# Altium project Relay Driver-10A-v1.0.PrjPcb (part 4 of 4)

## Sheet Relay_Sheet.SchDoc
size 420 x 297 mm; SheetNumber: 8; SheetTotal: 9
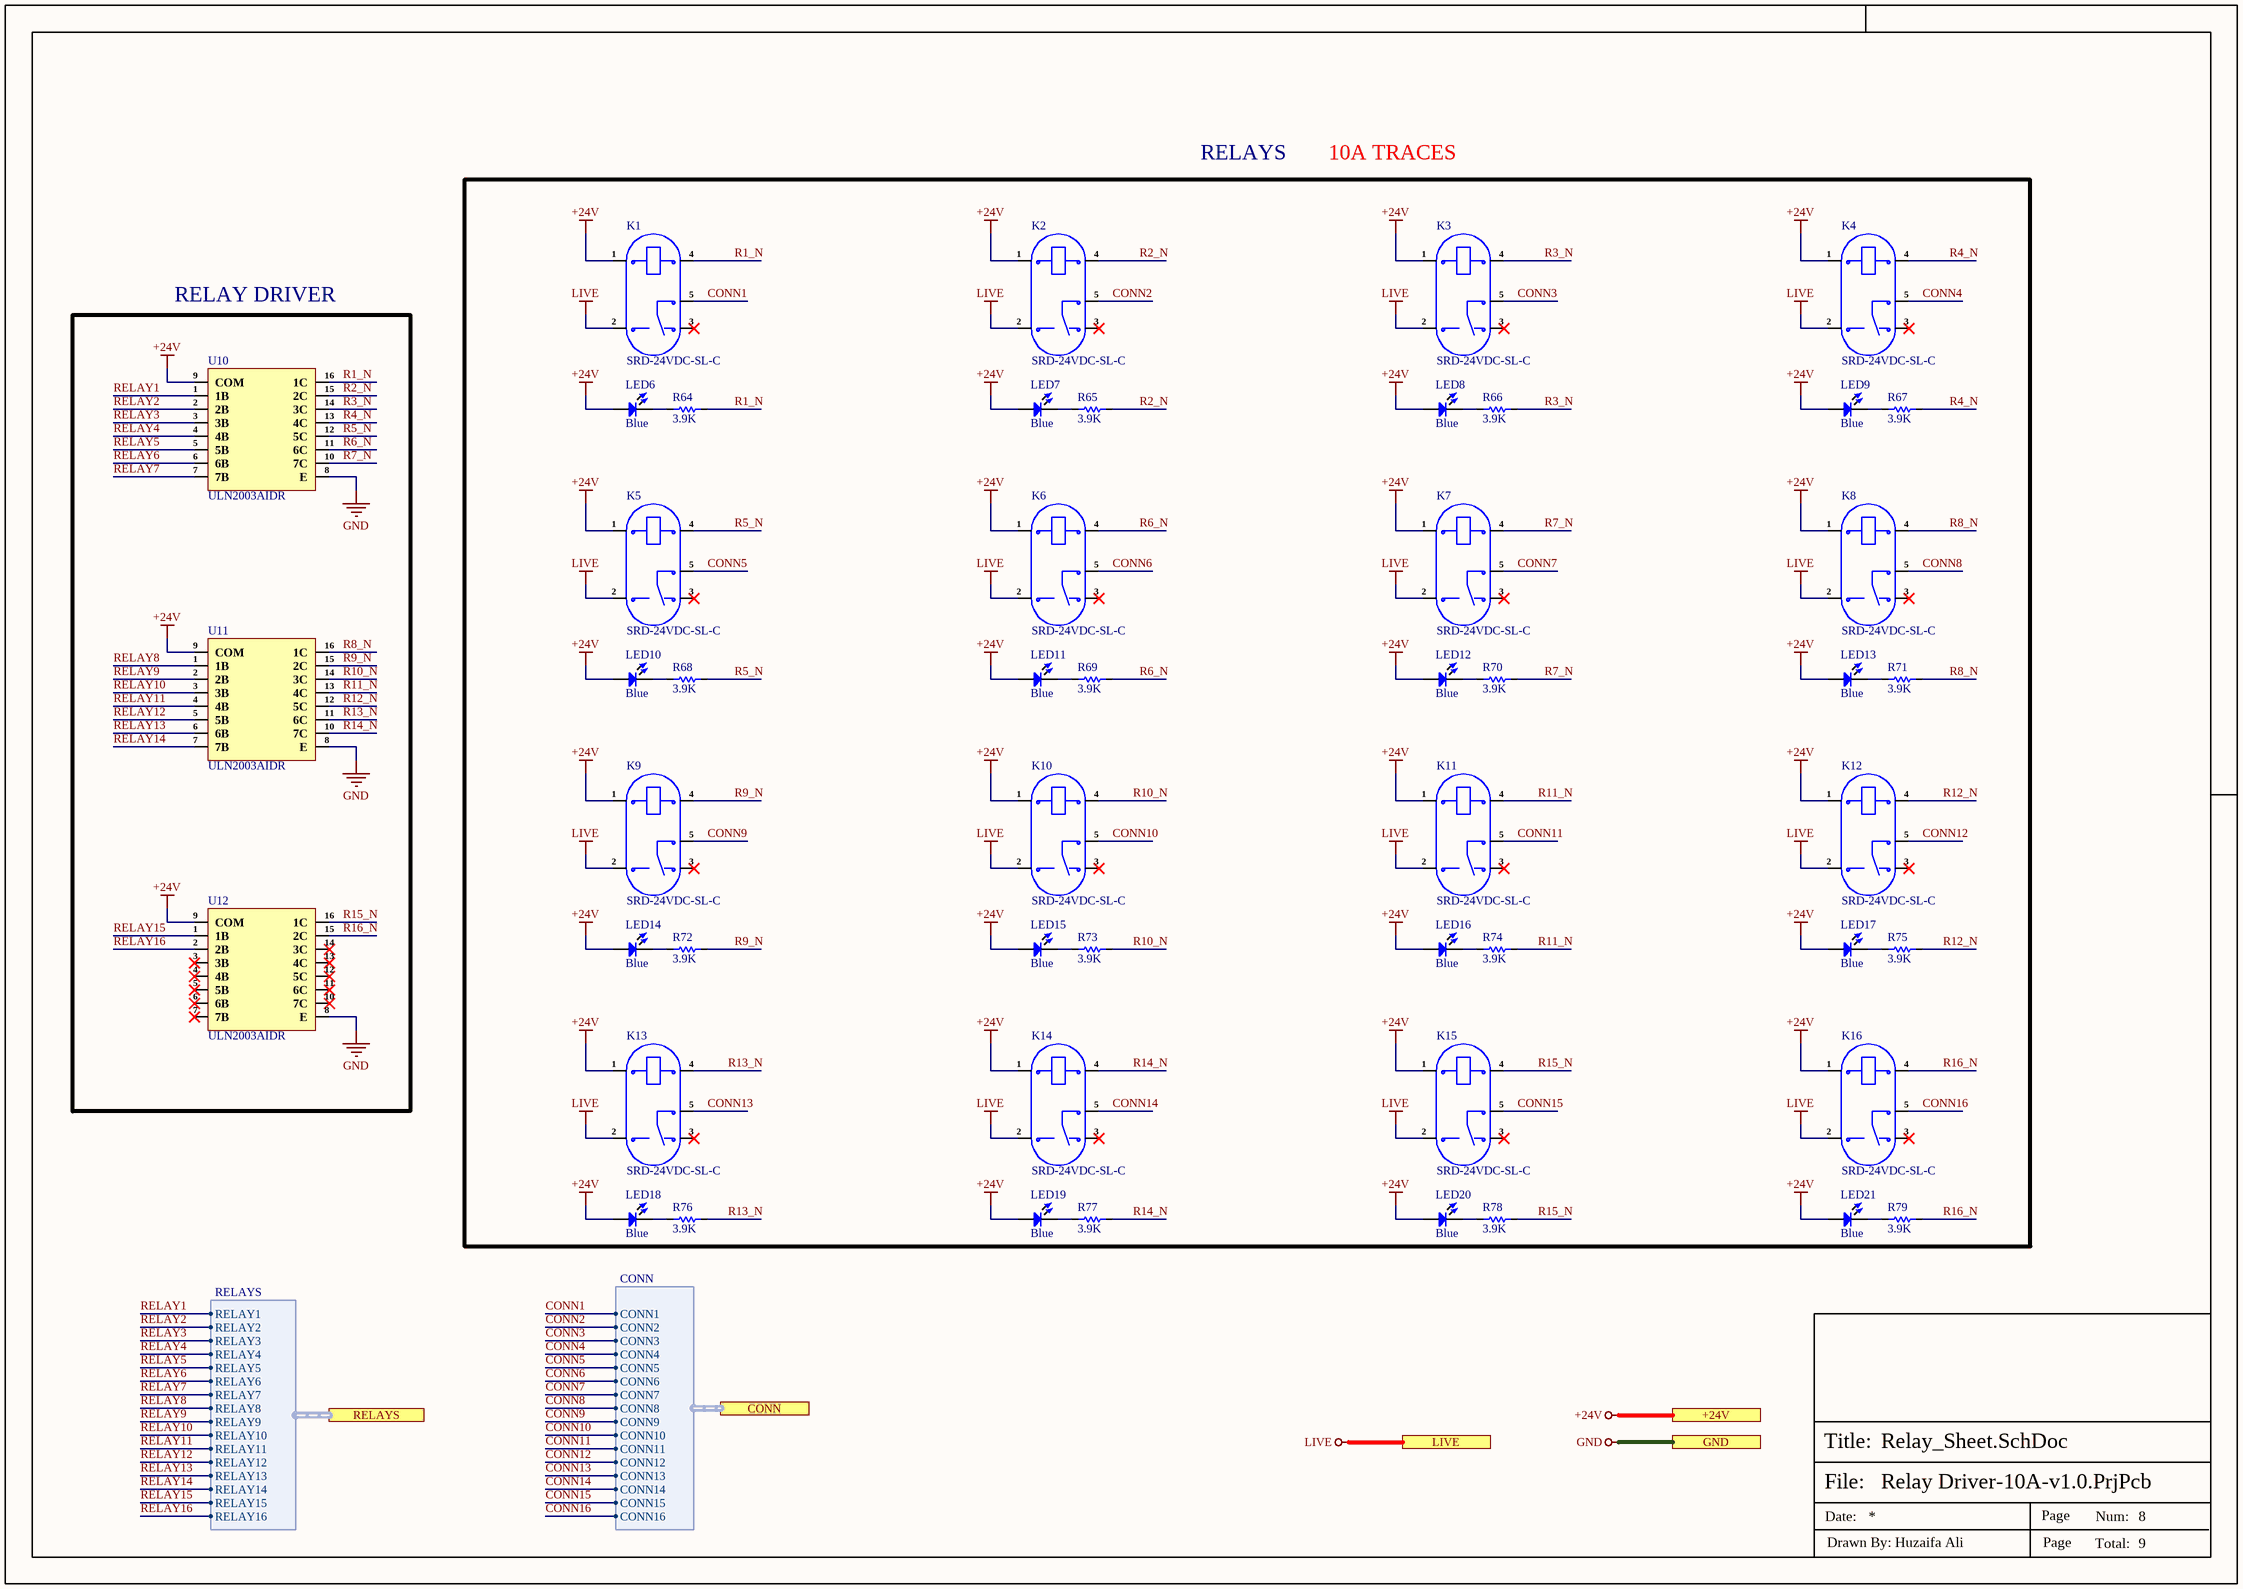
[diagram p6: Relay_Sheet.SchDoc]

### Parts
K1  SRD-24VDC-SL-C  [SRD-24VDC-SL-C]
K2  SRD-24VDC-SL-C  [SRD-24VDC-SL-C]
K3  SRD-24VDC-SL-C  [SRD-24VDC-SL-C]
K4  SRD-24VDC-SL-C  [SRD-24VDC-SL-C]
K5  SRD-24VDC-SL-C  [SRD-24VDC-SL-C]
K6  SRD-24VDC-SL-C  [SRD-24VDC-SL-C]
K7  SRD-24VDC-SL-C  [SRD-24VDC-SL-C]
K8  SRD-24VDC-SL-C  [SRD-24VDC-SL-C]
K9  SRD-24VDC-SL-C  [SRD-24VDC-SL-C]
K10  SRD-24VDC-SL-C  [SRD-24VDC-SL-C]
K11  SRD-24VDC-SL-C  [SRD-24VDC-SL-C]
K12  SRD-24VDC-SL-C  [SRD-24VDC-SL-C]
K13  SRD-24VDC-SL-C  [SRD-24VDC-SL-C]
K14  SRD-24VDC-SL-C  [SRD-24VDC-SL-C]
K15  SRD-24VDC-SL-C  [SRD-24VDC-SL-C]
K16  SRD-24VDC-SL-C  [SRD-24VDC-SL-C]
LED6  Blue  [LED-0603]
LED7  Blue  [LED-0603]
LED8  Blue  [LED-0603]
LED9  Blue  [LED-0603]
LED10  Blue  [LED-0603]
LED11  Blue  [LED-0603]
LED12  Blue  [LED-0603]
LED13  Blue  [LED-0603]
LED14  Blue  [LED-0603]
LED15  Blue  [LED-0603]
LED16  Blue  [LED-0603]
LED17  Blue  [LED-0603]
LED18  Blue  [LED-0603]
LED19  Blue  [LED-0603]
LED20  Blue  [LED-0603]
LED21  Blue  [LED-0603]
R64  3.9K  [Res-0402]
R65  3.9K  [Res-0402]
R66  3.9K  [Res-0402]
R67  3.9K  [Res-0402]
R68  3.9K  [Res-0402]
R69  3.9K  [Res-0402]
R70  3.9K  [Res-0402]
R71  3.9K  [Res-0402]
R72  3.9K  [Res-0402]
R73  3.9K  [Res-0402]
R74  3.9K  [Res-0402]
R75  3.9K  [Res-0402]
R76  3.9K  [Res-0402]
R77  3.9K  [Res-0402]
R78  3.9K  [Res-0402]
R79  3.9K  [Res-0402]
U10  ULN2003AIDR  [16-SOIC (0.154", 3.90mm Width)]
U11  ULN2003AIDR  [16-SOIC (0.154", 3.90mm Width)]
U12  ULN2003AIDR  [16-SOIC (0.154", 3.90mm Width)]

### Blocks framed on the sheet
RELAY DRIVER: U10-U12

### Ports
+24V (see Top_Sheet[3C], Connector_Sheet[5D], Power_Sheet[5D]), CONN (harness CONN, see Top_Sheet[3C], Connector_Sheet[2D]), GND (see Top_Sheet[3C], CAN_Sheet[5D], Connector_Sheet[5D], Controller_Sheet[5D], EtherCAT_Sheet[5D], Power_Sheet[5D], RJ45_Sheet[5D], RS485_RS232_Sheet[5D]), LIVE (see Top_Sheet[3C], Connector_Sheet[4D]), RELAYS (harness RELAYS, see Top_Sheet[3C], Controller_Sheet[4D])

### Harnesses
RELAYS: RELAY1, RELAY2, RELAY3, RELAY4, RELAY5, RELAY6, RELAY7, RELAY8, RELAY9, RELAY10, RELAY11, RELAY12, RELAY13, RELAY14, RELAY15, RELAY16
CONN: CONN1, CONN2, CONN3, CONN4, CONN5, CONN6, CONN7, CONN8, CONN9, CONN10, CONN11, CONN12, CONN13, CONN14, CONN15, CONN16

### Nets
+24V: K1.1 K2.1 K3.1 K4.1 K5.1 K6.1 K7.1 K8.1 K9.1 K10.1 K11.1 K12.1 K13.1 K14.1 K15.1 K16.1 LED6.1 LED7.1 LED8.1 LED9.1 LED10.1 LED11.1 LED12.1 LED13.1 LED14.1 LED15.1 LED16.1 LED17.1 LED18.1 LED19.1 LED20.1 LED21.1 U10.9(COM) U11.9(COM) U12.9(COM) ; port +24V
CONN1: K1.5 ; port CONN.CONN1
CONN2: K2.5 ; port CONN.CONN2
CONN3: K3.5 ; port CONN.CONN3
CONN4: K4.5 ; port CONN.CONN4
CONN5: K5.5 ; port CONN.CONN5
CONN6: K6.5 ; port CONN.CONN6
CONN7: K7.5 ; port CONN.CONN7
CONN8: K8.5 ; port CONN.CONN8
CONN9: K9.5 ; port CONN.CONN9
CONN10: K10.5 ; port CONN.CONN10
CONN11: K11.5 ; port CONN.CONN11
CONN12: K12.5 ; port CONN.CONN12
CONN13: K13.5 ; port CONN.CONN13
CONN14: K14.5 ; port CONN.CONN14
CONN15: K15.5 ; port CONN.CONN15
CONN16: K16.5 ; port CONN.CONN16
GND: U10.8(E) U11.8(E) U12.8(E) ; port GND
LIVE: K1.2 K2.2 K3.2 K4.2 K5.2 K6.2 K7.2 K8.2 K9.2 K10.2 K11.2 K12.2 K13.2 K14.2 K15.2 K16.2 ; port LIVE
R1_N: K1.4 R64.2 U10.16(1C)
R2_N: K2.4 R65.2 U10.15(2C)
R3_N: K3.4 R66.2 U10.14(3C)
R4_N: K4.4 R67.2 U10.13(4C)
R5_N: K5.4 R68.2 U10.12(5C)
R6_N: K6.4 R69.2 U10.11(6C)
R7_N: K7.4 R70.2 U10.10(7C)
R8_N: K8.4 R71.2 U11.16(1C)
R9_N: K9.4 R72.2 U11.15(2C)
R10_N: K10.4 R73.2 U11.14(3C)
R11_N: K11.4 R74.2 U11.13(4C)
R12_N: K12.4 R75.2 U11.12(5C)
R13_N: K13.4 R76.2 U11.11(6C)
R14_N: K14.4 R77.2 U11.10(7C)
R15_N: K15.4 R78.2 U12.16(1C)
R16_N: K16.4 R79.2 U12.15(2C)
RELAY1: U10.1(1B) ; port RELAYS.RELAY1
RELAY2: U10.2(2B) ; port RELAYS.RELAY2
RELAY3: U10.3(3B) ; port RELAYS.RELAY3
RELAY4: U10.4(4B) ; port RELAYS.RELAY4
RELAY5: U10.5(5B) ; port RELAYS.RELAY5
RELAY6: U10.6(6B) ; port RELAYS.RELAY6
RELAY7: U10.7(7B) ; port RELAYS.RELAY7
RELAY8: U11.1(1B) ; port RELAYS.RELAY8
RELAY9: U11.2(2B) ; port RELAYS.RELAY9
RELAY10: U11.3(3B) ; port RELAYS.RELAY10
RELAY11: U11.4(4B) ; port RELAYS.RELAY11
RELAY12: U11.5(5B) ; port RELAYS.RELAY12
RELAY13: U11.6(6B) ; port RELAYS.RELAY13
RELAY14: U11.7(7B) ; port RELAYS.RELAY14
RELAY15: U12.1(1B) ; port RELAYS.RELAY15
RELAY16: U12.2(2B) ; port RELAYS.RELAY16
NetLED6_2: LED6.2 R64.1
NetLED7_2: LED7.2 R65.1
NetLED8_2: LED8.2 R66.1
NetLED9_2: LED9.2 R67.1
NetLED10_2: LED10.2 R68.1
NetLED11_2: LED11.2 R69.1
NetLED12_2: LED12.2 R70.1
NetLED13_2: LED13.2 R71.1
NetLED14_2: LED14.2 R72.1
NetLED15_2: LED15.2 R73.1
NetLED16_2: LED16.2 R74.1
NetLED17_2: LED17.2 R75.1
NetLED18_2: LED18.2 R76.1
NetLED19_2: LED19.2 R77.1
NetLED20_2: LED20.2 R78.1
NetLED21_2: LED21.2 R79.1

Not connected (* = marked no-connect by the designer): K1 3*; K2 3*; K3 3*; K4 3*; K5 3*; K6 3*; K7 3*; K8 3*; K9 3*; K10 3*; K11 3*; K12 3*; K13 3*; K14 3*; K15 3*; K16 3*; U12 3(3B)* 4(4B)* 5(5B)* 6(6B)* 7(7B)* 10(7C)* 11(6C)* 12(5C)* 13(4C)* 14(3C)*

### Notes on the sheet
- RELAYS
- 10A TRACES
- File:
- Title:
- Date:
- Page
- Num:
- Total:
- Drawn By: Huzaifa Ali

### Library data of the parts
K1-K16 = SRD-24VDC-SL-C: 250V@AC 24V 15A SPDT (1 Form C) Plugin,15.6x19.2mm Power Relays ROHS; Manufacturer: Ningbo Forward Relay; Item Type: Relay; Supplier: LCSC; LCSC Part Number: C15840; Manufacturer Part Number: SRD-24VDC-SL-C; RoHS: No
LED6-LED21 = NCD0603B3: blue 0603 Light Emitting Diodes (LED) ROHS; Manufacturer: Foshan NationStar Optoelectronics; Manufacturer Part Number: NCD0603B3; Package: 0603; LCSC Part Number: C158101; Item Type: LED; ComponentLink1Description: LCSC; ComponentLink1URL: https://www.lcsc.com/product-detail/Light-Emitting-Diodes-LED_Foshan-NationStar-Optoelectronics-NCD0603B3_C158101.html
R64-R79 = RC0402FR-073K9L: RES 3.9K OHM 1% 1/16W 0402; Manufacturer: Yageo; Temperature Coefficient: 100ppm/°C; Power Rating: 62.5mW; Value: 3.9kR; Voltage Rating: 50V; Max Power Dissipation: 63mW; Item Type: Resistor; Supplier: Future Electronics; Supplier Part Number: 9808155; Manufacturer Part Number: RC0402FR-073K9L; RoHS: Yes; Category: Chip SMD Resistors; Stock: 6910000; Pricing: 10000=0.0011, 100000=0.0011, 300000=0.001, 750000=0.001, 2000000=0.0009 (USD); Case/Package: 0402; Case Code (Imperial): 0402; Case Code (Metric): 1005; Min Operating Temperature: -55°C; Max Operating Temperature: 155°C; Tolerance: 1%; Packaging: Tape and Reel; Resistor Type: Thick Film; Series: RC; Termination: SMD/SMT; Number of Terminations: 2; Features: Moisture Resistant; Resistance Tolerance: 1%; Construction: Rectangular; Voltage Rating (AC): 50V; Length: 1mm; Depth: 0.5mm; Lead Free: Lead Free; RoHS Compliant: Yes; Reach SVHC Compliant: Unknown; Military Standard: Not; ComponentLink1URL: https://datasheet.ciiva.com/12666/pyu-rc0402-51-rohs-l-6-r-12666997.pdf?src-supplier=Mouser; ComponentLink1Description: https://datasheet.ciiva.com/12666/pyu-rc0402-51-rohs-l-6-r-12666997.pdf?src-supplier=Mouser; ComponentLink2URL: https://datasheet.ciiva.com/7849/1018594-7849989.pdf?src-supplier=Element14; ComponentLink2Description: https://datasheet.ciiva.com/7849/1018594-7849989.pdf?src-supplier=Element14; ComponentLink3URL: https://datasheet.ciiva.com/7849/1018594-7849990.pdf?src-supplier=Element14; ComponentLink3Description: https://datasheet.ciiva.com/7849/1018594-7849990.pdf?src-supplier=Element14; ComponentLink4URL: https://datasheet.ciiva.com/15189/getdatasheetpartid-469246-15189453.pdf?src-supplier=Verical; ComponentLink4Description: https://datasheet.ciiva.com/15189/getdatasheetpartid-469246-15189453.pdf?src-supplier=Verical; LCSC Part Number: C131467
U10-U12 = ULN2003AIDR: IC PWR RELAY 7NPN 1:1 16SOIC; Manufacturer: Texas Instruments; Supplier: Mouser; Supplier Part Number: 595-ULN2003AIDR; Manufacturer Part Number: ULN2003AIDR; RoHS: Yes; Item Type: IC; Stock: 2012; Pricing: 1=0.66, 10=0.589, 50=0.589, 100=0.402, 1000=0.285, 10000=0.232 (USD); ComponentLink1URL: https://datasheet.ciiva.com/15139/getdatasheetpartid-47948-15139878.pdf?src-supplier=Verical; ComponentLink1Description: https://datasheet.ciiva.com/15139/getdatasheetpartid-47948-15139878.pdf?src-supplier=Verical; ComponentLink2URL: https://datasheet.ciiva.com/14424/ulq2003a-14424030.pdf?src-supplier=Avnet; ComponentLink2Description: https://datasheet.ciiva.com/14424/ulq2003a-14424030.pdf?src-supplier=Avnet; ComponentLink3URL: https://datasheet.ciiva.com/1700/uln2003ai-1700820.pdf?src-supplier=Digikey; ComponentLink3Description: https://datasheet.ciiva.com/1700/uln2003ai-1700820.pdf?src-supplier=Digikey; ComponentLink4URL: https://datasheet.ciiva.com/1700/uln2003ai-1700821.pdf?src-supplier=Digikey; ComponentLink4Description: https://datasheet.ciiva.com/1700/uln2003ai-1700821.pdf?src-supplier=Digikey; ComponentLink5URL: https://datasheet.ciiva.com/1700/uln2003ai-1700822.pdf?src-supplier=Digikey; ComponentLink5Description: https://datasheet.ciiva.com/1700/uln2003ai-1700822.pdf?src-supplier=Digikey

## Sheet RJ45_Sheet.SchDoc
size 420 x 297 mm; SheetNumber: 7; SheetTotal: 10
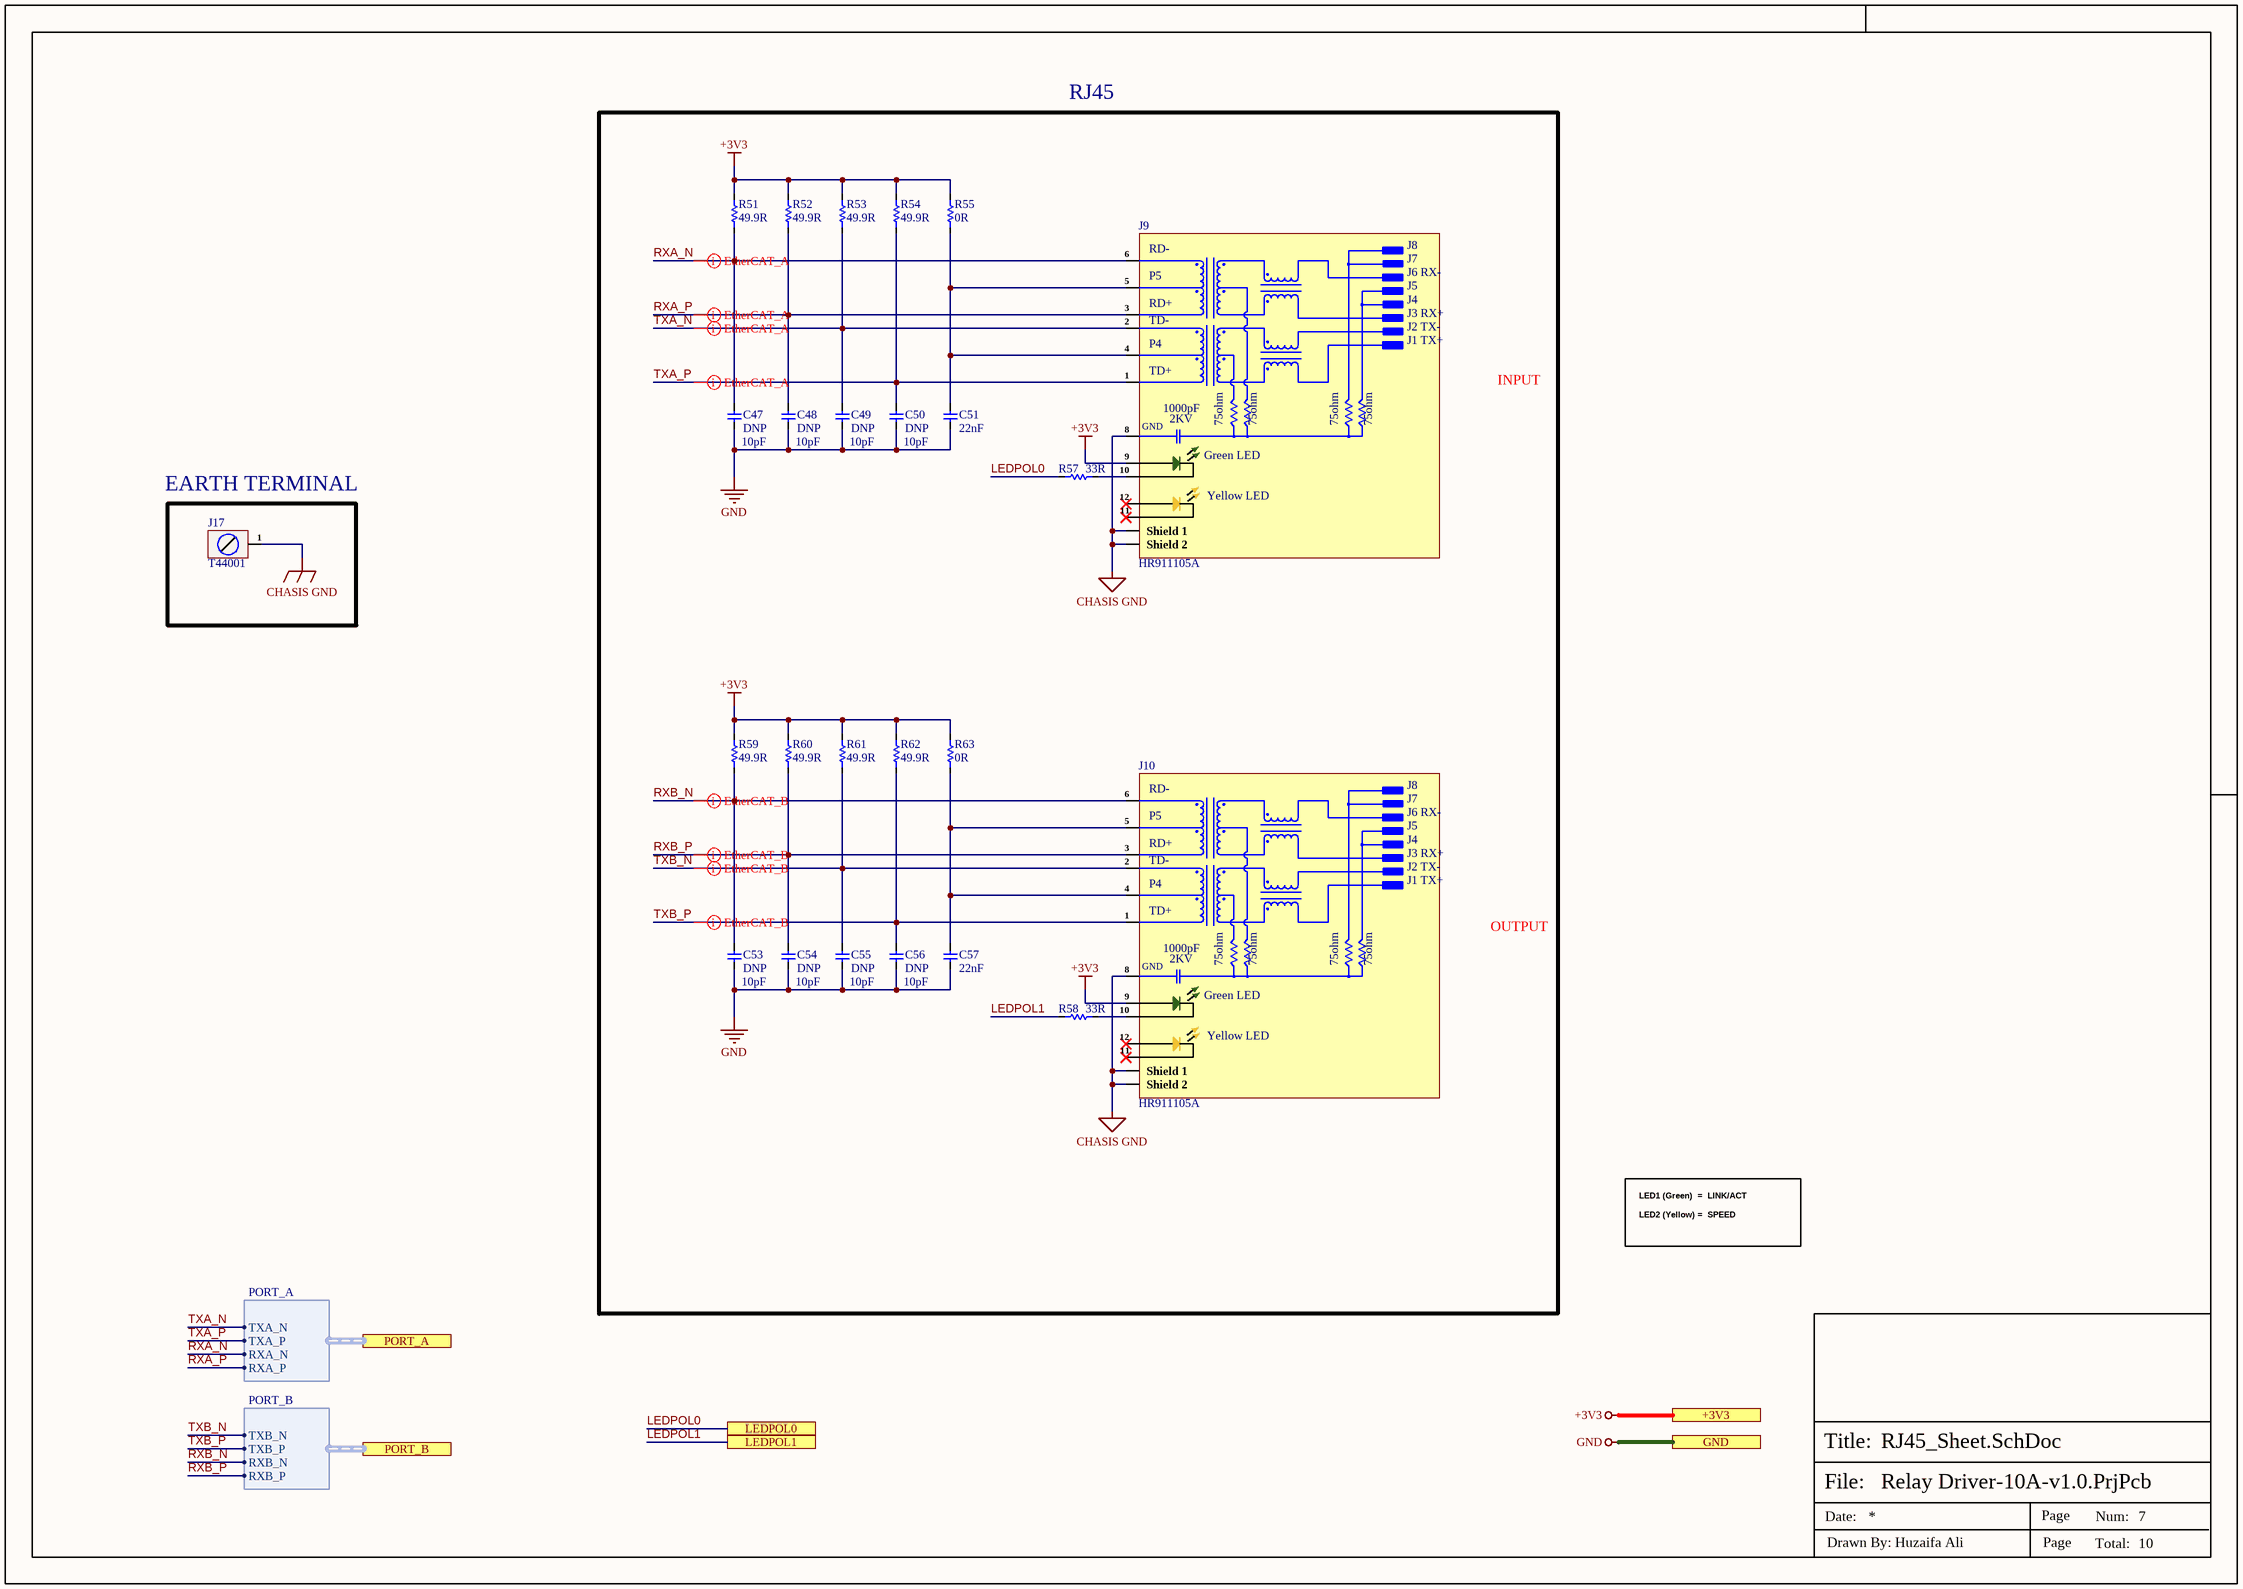
[diagram p7: RJ45_Sheet.SchDoc]

### Parts
C47  DNP  [Cap-0402]
C48  DNP  [Cap-0402]
C49  DNP  [Cap-0402]
C50  DNP  [Cap-0402]
C51  22nF  [Cap-0402]
C53  DNP  [Cap-0402]
C54  DNP  [Cap-0402]
C55  DNP  [Cap-0402]
C56  DNP  [Cap-0402]
C57  22nF  [Cap-0402]
J9  HR911105A  [HR911105A]
J10  HR911105A  [HR911105A]
J17  T44001  [T44001]
R51  49.9R  [Res-0603]
R52  49.9R  [Res-0603]
R53  49.9R  [Res-0603]
R54  49.9R  [Res-0603]
R55  0R  [Res-0402]
R57  33R  [Res-0402]
R58  33R  [Res-0402]
R59  49.9R  [Res-0603]
R60  49.9R  [Res-0603]
R61  49.9R  [Res-0603]
R62  49.9R  [Res-0603]
R63  0R  [Res-0402]

### Ports
+3V3 (see Top_Sheet[5C], CAN_Sheet[5D], Controller_Sheet[5D], EtherCAT_Sheet[5D], Power_Sheet[5D], RS485_RS232_Sheet[5D]), GND (see Top_Sheet[5C], CAN_Sheet[5D], Connector_Sheet[5D], Controller_Sheet[5D], EtherCAT_Sheet[5D], GPIO_Expander_Sheet[5D], Power_Sheet[5D], Relay_Sheet[5D], RS485_RS232_Sheet[5D]), LEDPOL0 (see Top_Sheet[5C], EtherCAT_Sheet[2D]), LEDPOL1 (see Top_Sheet[5C], EtherCAT_Sheet[2D]), PORT_A (harness PORT_A, see Top_Sheet[5C], EtherCAT_Sheet[3D]), PORT_B (harness PORT_B, see Top_Sheet[5C], EtherCAT_Sheet[3D])

### Harnesses
PORT_A: TXA_N, TXA_P, RXA_N, RXA_P
PORT_B: TXB_N, TXB_P, RXB_N, RXB_P

### Nets
+3V3: J9.9(ANODE) J10.9(ANODE) R51.2 R52.2 R53.2 R54.2 R55.2 R59.2 R60.2 R61.2 R62.2 R63.2 ; port +3V3
CHASIS GND: J9.8(GND) J9.Shield_1 J9.Shield_2 J10.8(GND) J10.Shield_1 J10.Shield_2 J17.1
GND: C47.1 C48.1 C49.1 C50.1 C51.1 C53.1 C54.1 C55.1 C56.1 C57.1 ; port GND
LEDPOL0: R57.1 ; port LEDPOL0
LEDPOL1: R58.1 ; port LEDPOL1
RXA_N: C47.2 J9.6(RD-) R51.1 ; port PORT_A.RXA_N
RXA_P: C48.2 J9.3(RD+) R52.1 ; port PORT_A.RXA_P
RXB_N: C53.2 J10.6(RD-) R59.1 ; port PORT_B.RXB_N
RXB_P: C54.2 J10.3(RD+) R60.1 ; port PORT_B.RXB_P
TXA_N: C49.2 J9.2(TD-) R53.1 ; port PORT_A.TXA_N
TXA_P: C50.2 J9.1(TD+) R54.1 ; port PORT_A.TXA_P
TXB_N: C55.2 J10.2(TD-) R61.1 ; port PORT_B.TXB_N
TXB_P: C56.2 J10.1(TD+) R62.1 ; port PORT_B.TXB_P
NetC51_2: C51.2 J9.4(P4) J9.5(P5) R55.1
NetC57_2: C57.2 J10.4(P4) J10.5(P5) R63.1
NetJ9_10: J9.10(CATHODE) R57.2
NetJ10_10: J10.10(CATHODE) R58.2

Not connected (* = marked no-connect by the designer): J9 11(CATHODE)* 12(ANODE_)*; J10 11(CATHODE)* 12(ANODE_)*

### Layout directives
differential pair; differential pair class EtherCAT_B_Lines; net class EtherCAT_B; rule Matched Net Lengths [Tolerance = 25.4mil]; rule Impedance Constraint [Min = 85.00    Max = 95.00    ]: RXB_N, RXB_P, TXB_N, TXB_P
differential pair; differential pair class EtherCAT_A_Lines; net class EtherCAT_A; rule Matched Net Lengths [Tolerance = 25.4mil]; rule Impedance Constraint [Min = 85.00    Max = 95.00    ]: RXA_N, RXA_P, TXA_N, TXA_P

### Notes on the sheet
- RJ45
- INPUT
- 10pF
- (near J17) EARTH TERMINAL
- OUTPUT
- LED1 (Green)  =  LINK/ACT
  LED2 (Yellow) =  SPEED
- File:
- Title:
- Date:
- Page
- Num:
- Total:
- Drawn By: Huzaifa Ali
- (in symbol HR911105A) J8; J7; J6 RX-; J5; J4; J3 RX+; J2 TX-; J1 TX+; 1000pF; 2KV; 75ohm; Green LED; Yellow LED

### Library data of the parts
C47-C50 C53-C56 = GRM1555C1H100JA01D: CAP CER 10PF 50V C0G/NP0 0402; Manufacturer: Murata; Material: Ceramic; Dielectric: C0G; Tolerance: 5%; Item Type: Capacitor; Supplier: Arrow Electronics; Supplier Part Number: GRM1555C1H100JA01D; Manufacturer Part Number: GRM1555C1H100JA01D; RoHS: Yes; Category: Ceramic Capacitors; Stock: 3860000; Pricing: 10000=0.0034, 50000=0.0027, 100000=0.0023, 250000=0.0021 (USD); Mounting Technology: Surface Mount; Case/Package: 0402; Case Code (Metric): 1005; Case Code (Imperial): 0402; Min Operating Temperature: -55°C; Max Operating Temperature: 125°C; Value: 10pF; Voltage Rating: 50V; Packaging: Tape and Reel; Package Quantity: 1; Voltage Rating (DC): 50V; Termination: SMD/SMT; Series: GRM; Voltage: 50V; Construction: Flat; Length: 1mm; Width: 0.02inch; Height: 0.5mm; Depth: 0.5mm; Thickness: 0.022inch; Radiation Hardening: No; RoHS Compliant: Yes; Lead Free: Lead Free; Reach SVHC Compliant: No; ComponentLink1URL: https://datasheet.ciiva.com/2989/product-2989280.pdf?src-supplier=Avnet; ComponentLink1Description: https://datasheet.ciiva.com/2989/product-2989280.pdf?src-supplier=Avnet; ComponentLink2URL: https://datasheet.ciiva.com/18184/getdatasheetpartid-307234-18184164.pdf?src-supplier=Verical; ComponentLink2Description: https://datasheet.ciiva.com/18184/getdatasheetpartid-307234-18184164.pdf?src-supplier=Verical; ComponentLink3URL: https://datasheet.ciiva.com/29200/453545-da-01-en-vs-kondensator-0402-29200107.pdf?src-supplier=Conrad; ComponentLink3Description: https://datasheet.ciiva.com/29200/453545-da-01-en-vs-kondensator-0402-29200107.pdf?src-supplier=Conrad; ComponentLink4URL: https://datasheet.ciiva.com/7828/1666664-7828812.pdf?src-supplier=Element14; ComponentLink4Description: https://datasheet.ciiva.com/7828/1666664-7828812.pdf?src-supplier=Element14; ComponentLink5URL: https://datasheet.ciiva.com/6271/partnumbering-e-01-6271159.pdf?src-supplier=Digi-Key; ComponentLink5Description: https://datasheet.ciiva.com/6271/partnumbering-e-01-6271159.pdf?src-supplier=Digi-Key; ComponentLink6URL: https://datasheet.ciiva.com/6271/partnumbering-e-01-6271158.pdf?src-supplier=Digi-Key; ComponentLink6Description: https://datasheet.ciiva.com/6271/partnumbering-e-01-6271158.pdf?src-supplier=Digi-Key; ComponentLink7URL: https://datasheet.ciiva.com/6271/partnumbering-e-01-6271068.pdf?src-supplier=Digi-Key; ComponentLink7Description: https://datasheet.ciiva.com/6271/partnumbering-e-01-6271068.pdf?src-supplier=Digi-Key; LCSC Part Number: C76946
C51 C57 = CC0402JRX7R7BB223: CAP CER 0.022UF 16V X7R 0402; Manufacturer: Yageo; Tolerance: 5%; Item Type: Capacitor; Supplier: Digikey; Supplier Part Number: 311-3758-1-ND; Manufacturer Part Number: CC0402JRX7R7BB223; RoHS: Yes; Category: Ceramic Capacitors; Stock: 4203; Pricing: 1=0.1, 10=0.033, 50=0.0192, 100=0.0149, 500=0.0112, 1000=0.0088, 2500=0.008, 5000=0.00736 (USD); Mounting Technology: Surface Mount; Case/Package: 0402; Case Code (Imperial): 0402; Case Code (Metric): 1005; Weight: 2.3E-05oz; Min Operating Temperature: -55°C; Max Operating Temperature: 125°C; Value: 22nF; Packaging: Tape and Reel; Voltage Rating: 16V; Voltage Rating (DC): 16V; Dielectric: X7R; Termination: SMD/SMT; Series: CC; Length: 0.039inch; Width: 0.5mm; Thickness: 0.022inch; RoHS Compliant: Yes; Halogen Free: 5694HalogenFree; Lead Free: 5697LeadFree; ComponentLink1URL: https://datasheet.ciiva.com/13264/upy-gphc-x7r-6-3v-to-50v-8-12304-13264039.pdf?src-supplier=Mouser; ComponentLink1Description: https://datasheet.ciiva.com/13264/upy-gphc-x7r-6-3v-to-50v-8-12304-13264039.pdf?src-supplier=Mouser; LCSC Part Number: C541459
J9 J10 = HR911105A: RJ45 RJReceptacle 1 WithLED Plugin Ethernet Connectors/Modular Connectors (RJ45 RJ11) ROHS; Manufacturer: HANRUN; Item Type: RJ45 Connector; Manufacturer Part Number: HR911105A; Package: Plugin; LCSC Part Number: C12074; ComponentLink1Description: LCSC; ComponentLink1URL: https://www.lcsc.com/product-detail/Ethernet-Connectors-Modular-Connectors-RJ45-RJ11_HANRUN-Zhongshan-HanRun-Elec-HR911105A_C12074.html
J17 = T44001: M4 Plugin PCB Welding Terminal ROHS; Manufacturer: XFCN; Manufacturer Part Number: T44001; Package: Plugin; ComponentLink1Description: LCSC; ComponentLink1URL: *
R51-R54 R59-R62 = RC0603FR-0749R9L: RES 49.9 OHM 1% 1/10W 0603; Manufacturer: Yageo; Temperature Coefficient: 100ppm/°C; Voltage Rating (DC): 50V; Power Rating: 100mW; Item Type: Resistor; Supplier 1: Arrow Electronics; Manufacturer Part Number: RC0603FR-0749R9L; RoHS: Yes; Category: Chip SMD Resistors; Stock 1: 2075000; Pricing 1: 5000=0.00280 (USD); Case/Package: 0603; Number of Pins: 2; Case Code (Imperial): 0603; Case Code (Metric): 1608; Size Code: 0603; Min Operating Temperature: -55°C; Max Operating Temperature: 155°C; Tolerance: 1%; Resistance: 49.9R; Resistor Type: Thick Film; Packaging: Tape and Reel; Voltage Rating: 50V; Termination: SMD/SMT; Features: Moisture Resistant; Series: RC; Max Power Dissipation: 100mW; Number of Terminations: 2; Construction: Rectangular; Resistance Tolerance: 1%; Technology: THICK FILM; Length: 1.6mm; Height: 0.45mm; Depth: 0.8mm; Lead Free: Lead Free; REACH SVHC: No SVHC; Military Standard: Not; RoHS Compliant: Yes; ComponentLink1URL: https://datasheet.ciiva.com/11808/0900766b80f96399-11808223.pdf?src-supplier=RSComponents; ComponentLink1Description: https://datasheet.ciiva.com/11808/0900766b80f96399-11808223.pdf?src-supplier=RSComponents; ComponentLink2URL: https://datasheet.ciiva.com/22747/443971-22747527.pdf?src-supplier=Element14; ComponentLink2Description: https://datasheet.ciiva.com/22747/443971-22747527.pdf?src-supplier=Element14; ComponentLink3URL: https://datasheet.ciiva.com/15189/getdatasheetpartid-325421-15189750.pdf?src-supplier=Verical; ComponentLink3Description: https://datasheet.ciiva.com/15189/getdatasheetpartid-325421-15189750.pdf?src-supplier=Verical; Supplier Part Number 1: RC0603FR-0749R9L; LCSC Part Number: C114625
R55 R63 = AC0402FR-070RL: RESISTOR 0402 JUMPER ZERO OHM; Manufacturer: Yageo; Voltage Rating: 50V; Power Rating: 62.5mW; Tolerance: 1%; Temperature Coefficient: 200ppm/°C; Supplier: Digi-Key; Supplier Part Number: 13-AC0402FR-070RLDKR-ND; Manufacturer Part Number: AC0402FR-070RL; RoHS: Yes; Category: Chip SMD Resistors; Stock: 337140; Pricing: 1=0.1, 10=0.017, 25=0.0132, 50=0.01, 100=0.0071, 250=0.00568, 500=0.00454, 1000=0.00335, 5000=0.0024 (USD); Case/Package: 0402; Case Code (Imperial): 0402; Case Code (Metric): 1005; Min Operating Temperature: -55°C; Max Operating Temperature: 155°C; Value: 0R; Packaging: Tape and Reel; Termination: SMD/SMT; Series: AC; Height: 370um; ComponentLink1URL: https://datasheet.ciiva.com/12656/pyu-ac-51-rohs-l-2-12656734.pdf?src-supplier=Mouser; ComponentLink1Description: https://datasheet.ciiva.com/12656/pyu-ac-51-rohs-l-2-12656734.pdf?src-supplier=Mouser; LCSC Part Number: C226739; Item Type: Resistor; ComponentLink2Description: LCSC; ComponentLink2URL: https://www.lcsc.com/product-detail/Chip-Resistor-Surface-Mount_YAGEO-AC0402FR-070RL_C226739.html
R57 R58 = RC0402FR-0733RL: RES 33 OHM 1% 1/16W 0402; Manufacturer: Yageo; Power Rating: 62.5mW; Voltage Rating: 50V; Temperature Coefficient: 100ppm/°C; Max Power Dissipation: 63mW; Supplier 1: Mouser; Manufacturer Part Number: RC0402FR-0733RL; RoHS: Yes; Category: Chip SMD Resistors; Stock 1: 1843488; Pricing 1: 1=0.10000, 10=0.01200, 50=0.01200, 100=0.00500, 1000=0.00300, 10000=0.00100 (USD); Case/Package: 0402; Number of Pins: 2; Case Code (Imperial): 0402; Case Code (Metric): 1005; Size Code: 0402; Min Operating Temperature: -55°C; Max Operating Temperature: 155°C; Resistor Type: Thick Film; Resistance: 33R; Tolerance: 1%; Packaging: Tape and Reel; Voltage Rating (DC): 50V; Package Quantity: 10000; Termination: SMD/SMT; Features: Moisture Resistant; Series: RC; Number of Terminations: 2; Resistance Tolerance: 1%; Construction: Rectangular; Technology: THICK FILM; Length: 1mm; Width: 0.5mm; Height: 0.35mm; Depth: 0.5mm; RoHS Compliant: Yes; REACH SVHC: Unknown; Military Standard: Not; Lead Free: Lead Free; ComponentLink1URL: https://datasheet.ciiva.com/11819/0900766b80c66297-11819487.pdf?src-supplier=RSComponents; ComponentLink1Description: https://datasheet.ciiva.com/11819/0900766b80c66297-11819487.pdf?src-supplier=RSComponents; ComponentLink2URL: https://datasheet.ciiva.com/24070/pyu-rc0402-51-rohs-l-6-r-8721-24070077.pdf?src-supplier=Mouser; ComponentLink2Description: https://datasheet.ciiva.com/24070/pyu-rc0402-51-rohs-l-6-r-8721-24070077.pdf?src-supplier=Mouser; ComponentLink3URL: https://datasheet.ciiva.com/7849/1018594-7849967.pdf?src-supplier=Element14; ComponentLink3Description: https://datasheet.ciiva.com/7849/1018594-7849967.pdf?src-supplier=Element14; ComponentLink4URL: https://datasheet.ciiva.com/7849/1018594-7849966.pdf?src-supplier=Element14; ComponentLink4Description: https://datasheet.ciiva.com/7849/1018594-7849966.pdf?src-supplier=Element14; ComponentLink5URL: https://datasheet.ciiva.com/15189/getdatasheetpartid-329253-15189431.pdf?src-supplier=Verical; ComponentLink5Description: https://datasheet.ciiva.com/15189/getdatasheetpartid-329253-15189431.pdf?src-supplier=Verical; ComponentLink6URL: https://datasheet.ciiva.com/17070/pyu-rc0402-51-rohs-l-6-r-17070335.pdf?src-supplier=Future+Electronics; ComponentLink6Description: https://datasheet.ciiva.com/17070/pyu-rc0402-51-rohs-l-6-r-17070335.pdf?src-supplier=Future+Electronics; Supplier Part Number 1: 603-RC0402FR-0733RL; LCSC Part Number: C138002

## Sheet RS485_RS232_Sheet.SchDoc
size 420 x 297 mm; SheetNumber: 5; SheetTotal: 10
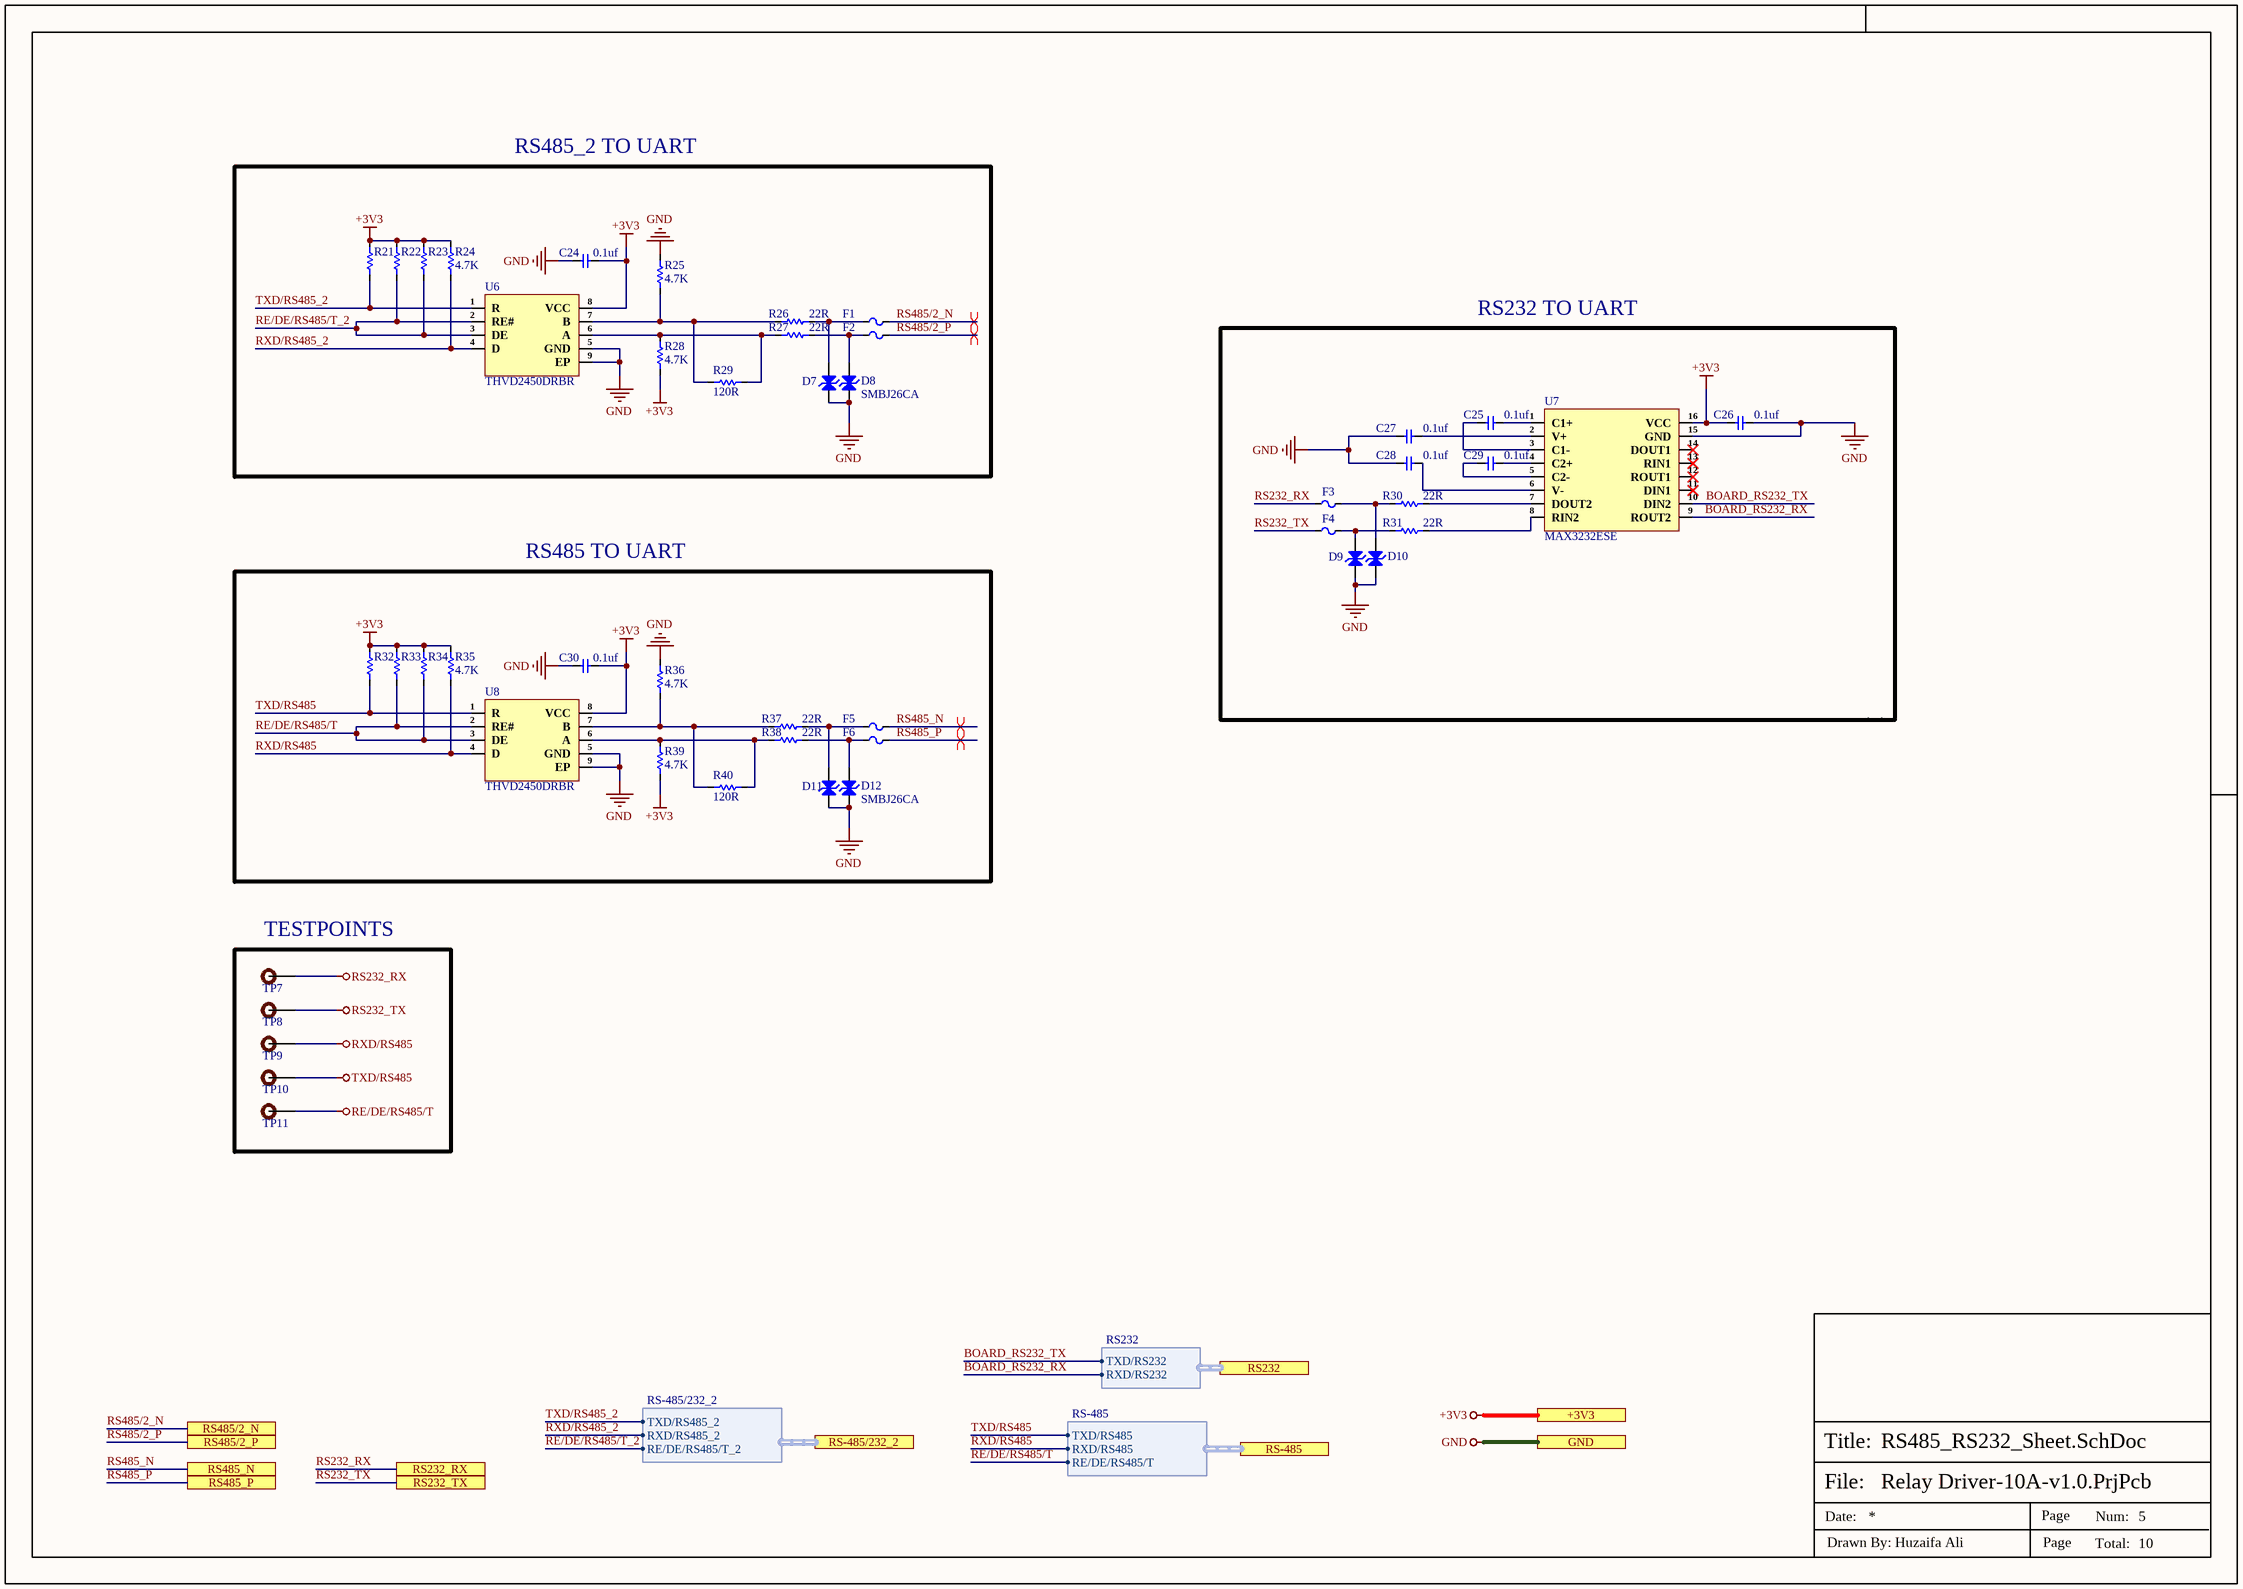
[diagram p8: RS485_RS232_Sheet.SchDoc]

### Parts
C24  0.1uf  [Cap-0402]
C25  0.1uf  [Cap-0402]
C26  0.1uf  [Cap-0402]
C27  0.1uf  [Cap-0402]
C28  0.1uf  [Cap-0402]
C29  0.1uf  [Cap-0402]
C30  0.1uf  [Cap-0402]
D7  SMBJ26CA  [SMB Bi Directional]  (value not drawn)
D8  SMBJ26CA  [SMB Bi Directional]
D9  SMBJ26CA  [SMB Bi Directional]  (value not drawn)
D10  SMBJ26CA  [SMB Bi Directional]  (value not drawn)
D11  SMBJ26CA  [SMB Bi Directional]  (value not drawn)
D12  SMBJ26CA  [SMB Bi Directional]
F1  SMD0805P020TF  [Fuse-0805]  (value not drawn)
F2  SMD0805P020TF  [Fuse-0805]  (value not drawn)
F3  SMD0805P020TF  [Fuse-0805]  (value not drawn)
F4  SMD0805P020TF  [Fuse-0805]  (value not drawn)
F5  SMD0805P020TF  [Fuse-0805]  (value not drawn)
F6  SMD0805P020TF  [Fuse-0805]  (value not drawn)
R21  4.7K  [Res-0402]  (value not drawn)
R22  4.7K  [Res-0402]  (value not drawn)
R23  4.7K  [Res-0402]  (value not drawn)
R24  4.7K  [Res-0402]
R25  4.7K  [Res-0402]
R26  22R  [Res-0201]
R27  22R  [Res-0201]
R28  4.7K  [Res-0402]
R29  120R  [Res-0603]
R30  22R  [Res-0201]
R31  22R  [Res-0201]
R32  4.7K  [Res-0402]  (value not drawn)
R33  4.7K  [Res-0402]  (value not drawn)
R34  4.7K  [Res-0402]  (value not drawn)
R35  4.7K  [Res-0402]
R36  4.7K  [Res-0402]
R37  22R  [Res-0201]
R38  22R  [Res-0201]
R39  4.7K  [Res-0402]
R40  120R  [Res-0603]
TP7  TEST POINT  [Test-point]  (value not drawn)  (no BOM)
TP8  TEST POINT  [Test-point]  (value not drawn)  (no BOM)
TP9  TEST POINT  [Test-point]  (value not drawn)  (no BOM)
TP10  TEST POINT  [Test-point]  (value not drawn)  (no BOM)
TP11  TEST POINT  [Test-point]  (value not drawn)  (no BOM)
U6  THVD2450DRBR  [SON-8-EP(3x3)]
U7  MAX3232ESE  [SOP-16]
U8  THVD2450DRBR  [SON-8-EP(3x3)]

### Ports
+3V3 (see Top_Sheet[4A], CAN_Sheet[5D], Controller_Sheet[5D], EtherCAT_Sheet[5D], Power_Sheet[5D], RJ45_Sheet[5D]), GND (see Top_Sheet[4A], CAN_Sheet[5D], Connector_Sheet[5D], Controller_Sheet[5D], EtherCAT_Sheet[5D], GPIO_Expander_Sheet[5D], Power_Sheet[5D], Relay_Sheet[5D], RJ45_Sheet[5D]), RS232 (harness RS232, see Top_Sheet[4A], Controller_Sheet[4D]), RS232_RX (see Top_Sheet[4B], Connector_Sheet[3D]), RS232_TX (see Top_Sheet[4B], Connector_Sheet[3D]), RS485/2_N (see Top_Sheet[4B], Connector_Sheet[3D]), RS485/2_P (see Top_Sheet[4B], Connector_Sheet[3D]), RS485_N (see Top_Sheet[4B], Connector_Sheet[3D]), RS485_P (see Top_Sheet[4B], Connector_Sheet[3D]), RS-485 (harness RS-485, see Top_Sheet[4A], Controller_Sheet[4D]), RS-485/232_2 (harness RS-485/232_2, see Top_Sheet[4B], Controller_Sheet[2D])

### Harnesses
RS-485: TXD/RS485, RXD/RS485, RE/DE/RS485/T
RS-485/232_2: TXD/RS485_2, RXD/RS485_2, RE/DE/RS485/T_2
RS232: TXD/RS232, RXD/RS232

### Nets
+3V3: C24.2 C26.2 C30.2 R21.2 R22.2 R23.2 R24.2 R28.1 R32.2 R33.2 R34.2 R35.2 R39.1 U6.8(VCC) U7.16(VCC) U8.8(VCC) ; port +3V3
GND: C24.1 C26.1 C27.1 C28.1 C30.1 D7.1(A) D8.1(A) D9.1(A) D10.1(A) D11.1(A) D12.1(A) R25.2 R36.2 U6.5(GND) U6.9(EP) U7.15(GND) U8.5(GND) U8.9(EP) ; port GND
RE/DE/RS485/T: R33.1 R34.1 TP11.1 U8.2(RE#) U8.3(DE) ; port RS-485.RE/DE/RS485/T
RS232_RX: F3.1 TP7.1 ; port RS232_RX
RS232_TX: F4.1 TP8.1 ; port RS232_TX
RXD/RS485: R35.1 TP9.1 U8.4(D) ; port RS-485.RXD/RS485
TXD/RS485: R32.1 TP10.1 U8.1(R) ; port RS-485.TXD/RS485
BOARD_RS232_RX: U7.9(ROUT2) ; port RS232.RXD/RS232
BOARD_RS232_TX: U7.10(DIN2) ; port RS232.TXD/RS232
RE/DE/RS485/T_2: R22.1 R23.1 U6.2(RE#) U6.3(DE) ; port RS-485/232_2.RE/DE/RS485/T_2
RS485/2_N: F1.2 ; port RS485/2_N
RS485/2_P: F2.2 ; port RS485/2_P
RS485_N: F5.2 ; port RS485_N
RS485_P: F6.2 ; port RS485_P
RXD/RS485_2: R24.1 U6.4(D) ; port RS-485/232_2.RXD/RS485_2
TXD/RS485_2: R21.1 U6.1(R) ; port RS-485/232_2.TXD/RS485_2
NetC25_1: C25.1 U7.1(C1+)
NetC25_2: C25.2 U7.3(C1-)
NetC27_2: C27.2 U7.2(V+)
NetC28_2: C28.2 U7.6(V-)
NetC29_1: C29.1 U7.4(C2+)
NetC29_2: C29.2 U7.5(C2-)
NetD7_2: D7.2(K) F1.1 R26.2
NetD8_2: D8.2(K) F2.1 R27.2
NetD9_2: D9.2(K) F4.2 R31.1
NetD10_2: D10.2(K) F3.2 R30.1
NetD11_2: D11.2(K) F5.1 R37.2
NetD12_2: D12.2(K) F6.1 R38.2
NetR25_1: R25.1 R26.1 R29.1 U6.7(B)
NetR27_1: R27.1 R28.2 R29.2 U6.6(A)
NetR30_2: R30.2 U7.7(DOUT2)
NetR31_2: R31.2 U7.8(RIN2)
NetR36_1: R36.1 R37.1 R40.1 U8.7(B)
NetR38_1: R38.1 R39.2 R40.2 U8.6(A)

Not connected (* = marked no-connect by the designer): U7 11(DIN1)* 12(ROUT1)* 13(RIN1)* 14(DOUT1)*

### Layout directives
differential pair; net class RS485; differential pair class RS485_LINES; rule Impedance Constraint [Min = 115.0    Max = 125.0    ]; rule Matched Net Lengths [Tolerance = 0.508mm]: RS485/2_N, RS485/2_P, RS485_N, RS485_P

### Notes on the sheet
- RS485_2 TO UART
- RS232 TO UART
- RS485 TO UART
- (near TP7) TESTPOINTS
- File:
- Title:
- Date:
- Page
- Num:
- Total:
- Drawn By: Huzaifa Ali

### Library data of the parts
C24-C30 = GRM155R62A104KE14D: CAP CER 0.1UF 100V X5R 0402; Manufacturer: Murata; Capacitance: 100nF; Tolerance: 10%; Item Type: Capacitor; Supplier 1: Arrow Electronics; Manufacturer Part Number: GRM155R62A104KE14D; RoHS: Yes; Category: Ceramic Capacitors; Stock 1: 870000; Pricing 1: 10000=0.00500, 20000=0.00410, 30000=0.00390, 50000=0.00370, 100000=0.00300 (USD); Mount: Surface Mount; Case/Package: 0402; Case Code (Metric): 1005; Case Code (Imperial): 0402; Weight: 0.000212oz; Min Operating Temperature: -55°C; Max Operating Temperature: 85°C; Packaging: Tape and Reel; Voltage Rating: 100V; Dielectric: X5R; Termination: SMD/SMT; Voltage Rating (DC): 100V; Package Quantity: 10000; Series: GRM; Length: 0.039inch; Width: 0.02inch; Height: 0.5mm; Thickness: 0.022inch; Reach SVHC Compliant: Yes; Lead Free: Lead Free; RoHS Compliant: Yes; ComponentLink1URL: http://www.farnell.com/datasheets/2079151.pdf?src-supplier=Farnell; ComponentLink1Description: http://www.farnell.com/datasheets/2079151.pdf?src-supplier=Farnell; ComponentLink2URL: http://www.mouser.com/ds/2/281/c02e-2905.pdf?src-supplier=Mouser; ComponentLink2Description: http://www.mouser.com/ds/2/281/c02e-2905.pdf?src-supplier=Mouser; ComponentLink3URL: http://www.farnell.com/datasheets/2079151.pdf?src-supplier=Element14; ComponentLink3Description: http://www.farnell.com/datasheets/2079151.pdf?src-supplier=Element14; ComponentLink4URL: http://search.murata.co.jp/Ceramy/image/img/A01X/G101/ENG/GRM155R62A104KE14-01.pdf?src-supplier=Digi-Key; ComponentLink4Description: http://search.murata.co.jp/Ceramy/image/img/A01X/G101/ENG/GRM155R62A104KE14-01.pdf?src-supplier=Digi-Key; ComponentLink5URL: http://www.farnell.com/datasheets/2079151.pdf?src-supplier=Newark; ComponentLink5Description: http://www.farnell.com/datasheets/2079151.pdf?src-supplier=Newark; Supplier Part Number 1: GRM155R62A104KE14D; LCSC Part Number: C162178
D7-D12 = SMBJ26CA: SMB(DO-214AA) TVS ROHS; Manufacturer: MSKSEMI; Item Type: Diode; Manufacturer Part Number: SMBJ26CA; Package: SMB(DO-214AA); LCSC Part Number: C5331111; ComponentLink1Description: LCSC; ComponentLink1URL: https://www.lcsc.com/product-detail/TVS_MSKSEMI-SMBJ26CA_C5331111.html
F1-F6 = SMD0805P020TF: 9V 200mA 100A 500mA 0805 Resettable Fuses ROHS; Manufacturer: RUILON; Item Type: Fuse; Manufacturer Part Number: SMD0805P020TF; Package: 0805; LCSC Part Number: C20976; ComponentLink1Description: LCSC; ComponentLink1URL: https://www.lcsc.com/product-detail/Resettable-Fuses_RUILON-Shenzhen-Ruilongyuan-Elec-SMD0805P020TF_C20976.html
R21-R25 R28 R32-R36 R39 = RC0402FR-074K7L: RES 4.7K OHM 1% 1/16W 0402; Manufacturer: Yageo; Voltage Rating (DC): 50V; Power Rating: 62.5mW; Resistance: 4.7kR; Temperature Coefficient: 100ppm/°C; Max Power Dissipation: 63mW; Item Type: Resistor; Supplier 1: Avnet; Manufacturer Part Number: RC0402FR-074K7L; RoHS: Yes; Category: Chip SMD Resistors; Stock 1: 2420000; Pricing 1: 10000=0.00085 (USD); Case/Package: 0402; Number of Pins: 2; Case Code (Imperial): 0402; Case Code (Metric): 1005; Size Code: 0402; Min Operating Temperature: -55°C; Max Operating Temperature: 155°C; Tolerance: 1%; Voltage Rating: 50V; Packaging: Tape and Reel; Resistor Type: Thick Film; Termination: SMD/SMT; Features: Moisture Resistant; Series: RC; Number of Terminations: 2; Resistance Tolerance: 1%; Construction: Rectangular; Length: 1mm; Width: 0.5mm; Height: 0.32mm; Depth: 0.5mm; Height - Seated (Max): 0.016inch; RoHS Compliant: Yes; Reach SVHC Compliant: Yes; Military Standard: Not; Lead Free: Lead Free; ComponentLink1URL: https://datasheet.ciiva.com/22661/1686128-22661342.pdf?src-supplier=Element14; ComponentLink1Description: https://datasheet.ciiva.com/22661/1686128-22661342.pdf?src-supplier=Element14; ComponentLink2URL: https://datasheet.ciiva.com/7850/1018594-7850022.pdf?src-supplier=Element14; ComponentLink2Description: https://datasheet.ciiva.com/7850/1018594-7850022.pdf?src-supplier=Element14; ComponentLink3URL: https://datasheet.ciiva.com/7850/1018594-7850023.pdf?src-supplier=Element14; ComponentLink3Description: https://datasheet.ciiva.com/7850/1018594-7850023.pdf?src-supplier=Element14; ComponentLink4URL: https://datasheet.ciiva.com/15215/getdatasheetpartid-328119-15215035.pdf?src-supplier=Verical; ComponentLink4Description: https://datasheet.ciiva.com/15215/getdatasheetpartid-328119-15215035.pdf?src-supplier=Verical; Supplier Part Number 1: RC0402FR-074K7L; LCSC Part Number: C105871
R26 R27 R30 R31 R37 R38 = RC0201FR-0722RL: RES 22 OHM 1% 1/20W 0201; Manufacturer: Yageo; Item Type: Resistor; Supplier: Future Electronics; Supplier Part Number: 5973409; Manufacturer Part Number: RC0201FR-0722RL; RoHS: Yes; Category: Chip SMD Resistors; Stock: 17980000; Pricing: 10000=0.0014, 50000=0.0013, 250000=0.0013, 750000=0.0012, 2000000=0.0011 (USD); ComponentLink1URL: https://datasheet.ciiva.com/7672/1563626-7672215.pdf?src-supplier=Element14; ComponentLink1Description: https://datasheet.ciiva.com/7672/1563626-7672215.pdf?src-supplier=Element14; LCSC Part Number: C155743
R29 R40 = RC0603JR-07120RL: RES 120 OHM 5% 1/10W 0603; Manufacturer: Yageo; Voltage Rating (AC): 50V; Item Type: Resistor; Supplier: Future Electronics; Supplier Part Number: 4045720; Manufacturer Part Number: RC0603JR-07120RL; RoHS: Yes; Category: Chip SMD Resistors; Stock: 570000; Pricing: 5000=0.0015, 75000=0.0015, 250000=0.0014, 750000=0.0013, 2500000=0.0012 (USD); ComponentLink1URL: https://datasheet.ciiva.com/15189/getdatasheetpartid-326532-15189850.pdf?src-supplier=Verical; ComponentLink1Description: https://datasheet.ciiva.com/15189/getdatasheetpartid-326532-15189850.pdf?src-supplier=Verical; ComponentLink2URL: https://datasheet.ciiva.com/2518/pyu-r-int-thick-7-2518850.pdf?src-supplier=Digi-Key; ComponentLink2Description: https://datasheet.ciiva.com/2518/pyu-r-int-thick-7-2518850.pdf?src-supplier=Digi-Key; ComponentLink3URL: https://datasheet.ciiva.com/2518/pyu-r-int-thick-7-2518851.pdf?src-supplier=Digi-Key; ComponentLink3Description: https://datasheet.ciiva.com/2518/pyu-r-int-thick-7-2518851.pdf?src-supplier=Digi-Key; ComponentLink4URL: https://datasheet.ciiva.com/2518/pyu-r-int-thick-7-2518852.pdf?src-supplier=Digi-Key; ComponentLink4Description: https://datasheet.ciiva.com/2518/pyu-r-int-thick-7-2518852.pdf?src-supplier=Digi-Key; ComponentLink5URL: https://datasheet.ciiva.com/46395/443971-46395070.pdf?src-supplier=Element14; ComponentLink5Description: https://datasheet.ciiva.com/46395/443971-46395070.pdf?src-supplier=Element14; ComponentLink6URL: https://datasheet.ciiva.com/12555/rc0603-272842-12555246.pdf?src-supplier=Mouser; ComponentLink6Description: https://datasheet.ciiva.com/12555/rc0603-272842-12555246.pdf?src-supplier=Mouser; LCSC Part Number: C114681
TP7-TP11 = TEST POINT: Test Point ON; Item Type: TEST POINT
U6 U8 = THVD2450DRBR: IC TRANSCEIVER HALF 1/1 8SON; Manufacturer: Texas Instruments; Supplier: Digikey; Supplier Part Number: 296-THVD2450DRBRCT-ND; Manufacturer Part Number: THVD2450DRBR; RoHS: Yes; Item Type: IC; Stock: 2652; Pricing: 1=4.05, 10=3.639, 25=3.4404, 100=2.9818, 250=2.82892, 500=2.53838, 1000=2.1408 (USD); Pins: 8NUMBER; Length: 3mm; Width: 3mm; Height: 1mm; Thickness: 880um; LCSC Part Number: C2878080
U7 = MAX3232ESE: 250Kbps transceiver 2/2 SOP-16 RS232 ICs ROHS; Manufacturer: UMW; Item Type: IC; Manufacturer Part Number: MAX3232ESE; Package: SOP-16; LCSC Part Number: C2904738; ComponentLink1Description: LCSC; ComponentLink1URL: https://www.lcsc.com/product-detail/RS232-ICs_UMW-Youtai-Semiconductor-Co-Ltd-MAX3232ESE_C2904738.html

## Sheet GPIO_Expander_Sheet.SchDoc
size 420 x 297 mm; SheetNumber: 9; SheetTotal: 10
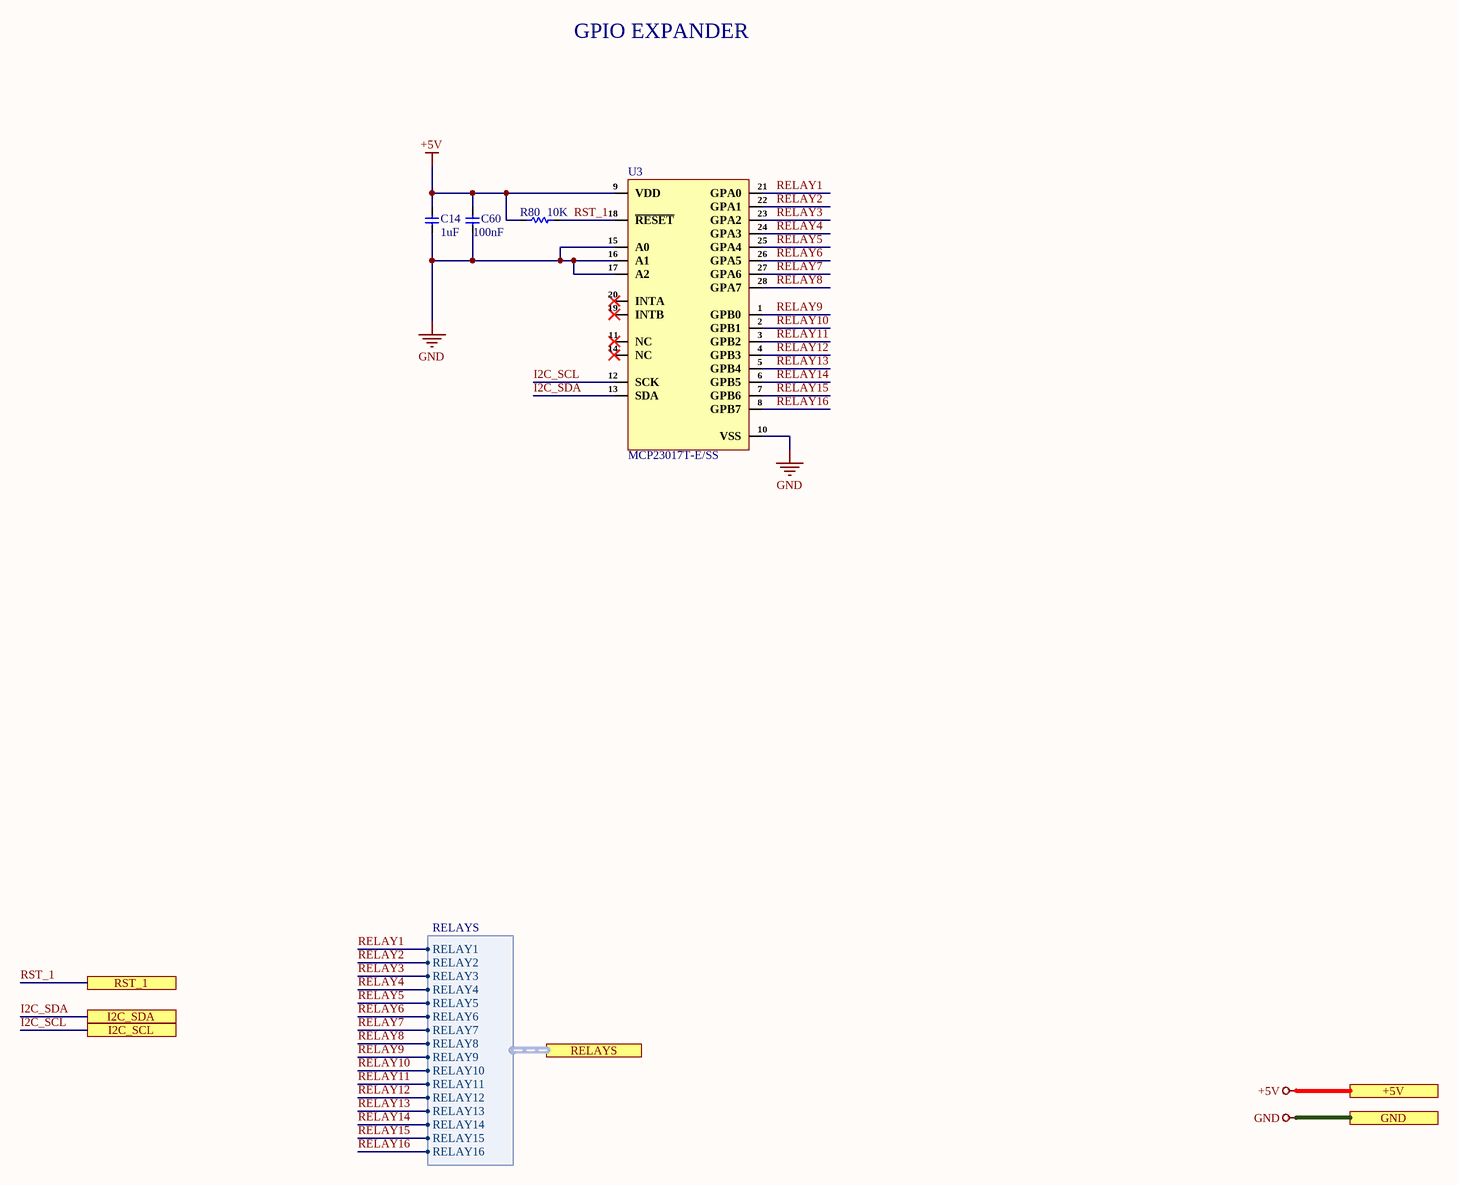
[diagram p9: GPIO_Expander_Sheet.SchDoc]

### Parts
C14  1uF  [Cap-0402]
C60  100nF  [cap-0402]
R80  10K  [Res-0402]
U3  MCP23017T-E/SS  [SSOP-28-208mil]

### Ports
+5V (see Top_Sheet[1B], CAN_Sheet[5D], Power_Sheet[5D]), GND (see Top_Sheet[1B], CAN_Sheet[5D], Connector_Sheet[5D], Controller_Sheet[5D], EtherCAT_Sheet[5D], Power_Sheet[5D], Relay_Sheet[5D], RJ45_Sheet[5D], RS485_RS232_Sheet[5D]), I2C_SCL (see Top_Sheet[1B], Controller_Sheet[3D]), I2C_SDA (see Top_Sheet[1B], Controller_Sheet[3D]), RELAYS (harness RELAYS, see Top_Sheet[2B], Relay_Sheet[1D]), RST_1 (see Top_Sheet[2B], Controller_Sheet[1D])

### Harnesses
RELAYS: RELAY1, RELAY2, RELAY3, RELAY4, RELAY5, RELAY6, RELAY7, RELAY8, RELAY9, RELAY10, RELAY11, RELAY12, RELAY13, RELAY14, RELAY15, RELAY16

### Nets
+5V: C14.2 C60.2 R80.2 U3.9(VDD) ; port +5V
GND: C14.1 C60.1 U3.10(VSS) U3.15(A0) U3.16(A1) U3.17(A2) ; port GND
I2C_SCL: U3.12(SCK) ; port I2C_SCL
I2C_SDA: U3.13(SDA) ; port I2C_SDA
RELAY1: U3.21(GPA0) ; port RELAYS.RELAY1
RELAY2: U3.22(GPA1) ; port RELAYS.RELAY2
RELAY3: U3.23(GPA2) ; port RELAYS.RELAY3
RELAY4: U3.24(GPA3) ; port RELAYS.RELAY4
RELAY5: U3.25(GPA4) ; port RELAYS.RELAY5
RELAY6: U3.26(GPA5) ; port RELAYS.RELAY6
RELAY7: U3.27(GPA6) ; port RELAYS.RELAY7
RELAY8: U3.28(GPA7) ; port RELAYS.RELAY8
RELAY9: U3.1(GPB0) ; port RELAYS.RELAY9
RELAY10: U3.2(GPB1) ; port RELAYS.RELAY10
RELAY11: U3.3(GPB2) ; port RELAYS.RELAY11
RELAY12: U3.4(GPB3) ; port RELAYS.RELAY12
RELAY13: U3.5(GPB4) ; port RELAYS.RELAY13
RELAY14: U3.6(GPB5) ; port RELAYS.RELAY14
RELAY15: U3.7(GPB6) ; port RELAYS.RELAY15
RELAY16: U3.8(GPB7) ; port RELAYS.RELAY16
RST_1: R80.1 U3.18(~{RESET}) ; port RST_1

Not connected (* = marked no-connect by the designer): U3 11(NC)* 14(NC)* 19(INTB)* 20(INTA)*

### Notes on the sheet
- GPIO EXPANDER
- File:
- Title:
- Date:
- Page
- Num:
- Total:
- Drawn By: Huzaifa Ali

### Library data of the parts
C14 = CC0402KRX5R6BB105: CAP CER 1UF 10V X5R 0402; Manufacturer: Yageo; Tolerance: 10%; Dissipation Factor: 15%; Item Type: Capacitor; Supplier 1: Mouser; Manufacturer Part Number: CC0402KRX5R6BB105; RoHS: Yes; Category: Ceramic Capacitors; Stock 1: 6711367; Pricing 1: 1=0.11000, 10=0.05500, 50=0.05500, 100=0.03300, 500=0.02700, 1000=0.02200, 2500=0.02100, 10000=0.01800 (USD); Mount: Surface Mount; Case/Package: 0402; Number of Pins: 2; Case Code (Metric): 1005; Case Code (Imperial): 0402; Min Operating Temperature: -55°C; Max Operating Temperature: 85°C; Capacitance: 1uF; Dielectric: X5R; Package Quantity: 1; Voltage Rating: 10V; Packaging: Tape and Reel; Voltage Rating (DC): 10V; Termination: SMD/SMT; Resistor Type: Ceramic; Series: CC; Construction: Flat; Length: 1mm; Width: 0.02inch; Height: 0.5mm; Thickness: 0.022inch; Depth: 0.5mm; Radiation Hardening: No; REACH SVHC: No SVHC; Lead Free: Lead Free; Halogen Free: Halogen Free; RoHS Compliant: Yes; ComponentLink1URL: https://datasheet.ciiva.com/176/upy-gphc-x5r-4v-to-50v-12-176704.pdf?src-supplier=Digi-Key; ComponentLink1Description: https://datasheet.ciiva.com/176/upy-gphc-x5r-4v-to-50v-12-176704.pdf?src-supplier=Digi-Key; ComponentLink2URL: https://datasheet.ciiva.com/176/mlccorderingcode-176705.pdf?src-supplier=Digi-Key; ComponentLink2Description: https://datasheet.ciiva.com/176/mlccorderingcode-176705.pdf?src-supplier=Digi-Key; ComponentLink3URL: https://datasheet.ciiva.com/176/mlccorderingcode-176706.pdf?src-supplier=Digi-Key; ComponentLink3Description: https://datasheet.ciiva.com/176/mlccorderingcode-176706.pdf?src-supplier=Digi-Key; Supplier Part Number 1: 603-CC402KRX5R6BB105; LCSC Part Number: C106254
C60 = C1005X7R1H104KT000F: CAP CER 0.1UF 50V X7R 0402; Manufacturer: TDK; Tolerance: 10%; Voltage: 25V; Item Type: Capacitor; Supplier 1: Avnet; Manufacturer Part Number: C1005X7R1H104KT000F; RoHS: No; Category: Ceramic Capacitors; Dielectric: X7R; Supplier Part Number 1: C1005X7R1H104KT000F; LCSC Part Number: C361198; ComponentLink1Description: LCSC; ComponentLink1URL: https://www.lcsc.com/product-detail/Multilayer-Ceramic-Capacitors-MLCC-SMD-SMT_TDK-C1005X7R1H104KT000F_C361198.html
R80 = RC0402FR-0710KL: RES 10K OHM 1% 1/16W 0402; Manufacturer: Yageo; Resistance: 10kR; Voltage Rating (DC): 50V; Temperature Coefficient: 100ppm/°C; Power Rating: 62.5mW; Max Power Dissipation: 63mW; Item Type: Resistor; Supplier 1: Mouser; Manufacturer Part Number: RC0402FR-0710KL; RoHS: Yes; Category: Chip SMD Resistors; Stock 1: 18648329; Pricing 1: 1=0.10000, 10=0.01400, 50=0.01400, 100=0.00500, 1000=0.00300, 10000=0.00200 (USD); Case/Package: 0402; Number of Pins: 2; Case Code (Imperial): 0402; Case Code (Metric): 1005; Min Operating Temperature: -55°C; Max Operating Temperature: 155°C; Resistor Type: Thick Film; Tolerance: 1%; Packaging: Tape and Reel; Voltage Rating: 50V; Termination: SMD/SMT; Working Voltage: 50V; Number of Terminations: 2; Features: Moisture Resistant; Series: RC; Resistance Tolerance: 1%; Construction: Rectangular; Length: 1mm; Width: 0.5mm; Height: 0.32mm; Depth: 0.5mm; Lead Pitch: 0.2mm; REACH SVHC: No SVHC; Lead Free: Lead Free; RoHS Compliant: Yes; Military Standard: Not; ComponentLink1URL: https://datasheet.ciiva.com/7660/38568-7660787.pdf?src-supplier=Element14; ComponentLink1Description: https://datasheet.ciiva.com/7660/38568-7660787.pdf?src-supplier=Element14; ComponentLink2URL: https://datasheet.ciiva.com/7849/1686128-7849814.pdf?src-supplier=Element14; ComponentLink2Description: https://datasheet.ciiva.com/7849/1686128-7849814.pdf?src-supplier=Element14; ComponentLink3URL: https://datasheet.ciiva.com/7983/1018594-7983486.pdf?src-supplier=Element14; ComponentLink3Description: https://datasheet.ciiva.com/7983/1018594-7983486.pdf?src-supplier=Element14; ComponentLink4URL: https://datasheet.ciiva.com/22747/1018594-22747512.pdf?src-supplier=Element14; ComponentLink4Description: https://datasheet.ciiva.com/22747/1018594-22747512.pdf?src-supplier=Element14; ComponentLink5URL: https://datasheet.ciiva.com/12667/pyu-rc0402-51-rohs-l-6-r-12667067.pdf?src-supplier=Mouser; ComponentLink5Description: https://datasheet.ciiva.com/12667/pyu-rc0402-51-rohs-l-6-r-12667067.pdf?src-supplier=Mouser; ComponentLink6URL: https://datasheet.ciiva.com/7849/1784430-7849813.pdf?src-supplier=Element14; ComponentLink6Description: https://datasheet.ciiva.com/7849/1784430-7849813.pdf?src-supplier=Element14; ComponentLink7URL: https://datasheet.ciiva.com/7849/1784430-7849815.pdf?src-supplier=Element14; ComponentLink7Description: https://datasheet.ciiva.com/7849/1784430-7849815.pdf?src-supplier=Element14; Supplier Part Number 1: 603-RC0402FR-0710KL; LCSC Part Number: C60490
U3 = MCP23017T-E/SS: IC XPNDR 1.7MHZ I2C 28SSOP; Manufacturer: Microchip; Operating Supply Voltage: 5.5V; Interface: I2C,Serial; Number of Channels: 1; Output Current: 25mA; Number of I/Os: 16; Power Dissipation: 700mW; Clock Frequency: 10MHz; Output Type: PUSH-PULL; Supply Current: 1mA; Supplier 1: Digi-Key; Manufacturer Part Number: MCP23017T-E/SS; RoHS: Yes; Category: Interface ICs; Stock 1: 26314; Pricing 1: 1=1.69, 25=1.4, 100=1.28 (USD); Mounting Technology: Surface Mount; Case/Package: SSOP; Pins: 28; Min Operating Temperature: -40°C; Max Operating Temperature: 125°C; Package Quantity: 2100; Series: -; Packaging: Tape and Reel; Frequency: 1.7MHz; Number of Bits: 16; Nominal Supply Voltage: 5.5V; Lead Free: Lead Free; RoHS Compliant: Yes; ComponentLink1URL: https://datasheet.ciiva.com/12267/21952b-12267583.pdf?src-supplier=Mouser; ComponentLink1Description: https://datasheet.ciiva.com/12267/21952b-12267583.pdf?src-supplier=Mouser; ComponentLink2URL: https://datasheet.ciiva.com/8128/21952b-8128586.pdf?src-supplier=Avnet; ComponentLink2Description: https://datasheet.ciiva.com/8128/21952b-8128586.pdf?src-supplier=Avnet; ComponentLink3URL: https://datasheet.ciiva.com/16454/filehandler-aspxddocname-en023709-16454267.pdf?src-supplier=Future+Electronics; ComponentLink3Description: https://datasheet.ciiva.com/16454/filehandler-aspxddocname-en023709-16454267.pdf?src-supplier=Future+Electronics; ComponentLink4URL: https://datasheet.ciiva.com/1780/21952b-1780738.pdf?src-supplier=Digi-Key; ComponentLink4Description: https://datasheet.ciiva.com/1780/21952b-1780738.pdf?src-supplier=Digi-Key; Supplier Part Number 1: MCP23017T-E/SSCT-ND; LCSC Part Number: C558584; Item Type: IC

## Nets that join several sheets
+3V3: CAN_Sheet (C22.2 U5.5), Controller_Sheet (13 pins), EtherCAT_Sheet (19 pins), Power_Sheet (5 pins), RJ45_Sheet (12 pins), RS485_RS232_Sheet (16 pins)
+5V: CAN_Sheet (6 pins), Power_Sheet (7 pins), GPIO_Expander_Sheet (C14.2 C60.2 R80.2 U3.9)
+24V: Connector_Sheet (D13.2 J13.1), Power_Sheet (10 pins), Relay_Sheet (35 pins)
CAN_RX: CAN_Sheet (TP5.1 U5.4), Controller_Sheet (U4.15)
CAN_TX: CAN_Sheet (TP6.1 U5.1), Controller_Sheet (U4.16)
CONN1: Connector_Sheet (J21.7 J40.1 J40.3), Relay_Sheet (K1.5)
CONN2: Connector_Sheet (J21.5 J41.1 J41.3), Relay_Sheet (K2.5)
CONN3: Connector_Sheet (J21.3 J48.1 J48.3), Relay_Sheet (K3.5)
CONN4: Connector_Sheet (J21.1 J49.1 J49.3), Relay_Sheet (K4.5)
CONN5: Connector_Sheet (J22.7 J42.1 J42.3), Relay_Sheet (K5.5)
CONN6: Connector_Sheet (J22.5 J43.1 J43.3), Relay_Sheet (K6.5)
CONN7: Connector_Sheet (J22.3 J50.1 J50.3), Relay_Sheet (K7.5)
CONN8: Connector_Sheet (J22.1 J51.1 J51.3), Relay_Sheet (K8.5)
CONN9: Connector_Sheet (J19.7 J36.1 J36.3), Relay_Sheet (K9.5)
CONN10: Connector_Sheet (J19.5 J37.1 J37.3), Relay_Sheet (K10.5)
CONN11: Connector_Sheet (J19.3 J44.1 J44.3), Relay_Sheet (K11.5)
CONN12: Connector_Sheet (J19.1 J45.1 J45.3), Relay_Sheet (K12.5)
CONN13: Connector_Sheet (J20.7 J38.1 J38.3), Relay_Sheet (K13.5)
CONN14: Connector_Sheet (J20.5 J39.1 J39.3), Relay_Sheet (K14.5)
CONN15: Connector_Sheet (J20.3 J46.1 J46.3), Relay_Sheet (K15.5)
CONN16: Connector_Sheet (J20.1 J47.1 J47.3), Relay_Sheet (K16.5)
GND: CAN_Sheet (8 pins), Connector_Sheet (19 pins), Controller_Sheet (29 pins), EtherCAT_Sheet (26 pins), Power_Sheet (22 pins), Relay_Sheet (U10.8 U11.8 U12.8), RJ45_Sheet (10 pins), RS485_RS232_Sheet (18 pins), GPIO_Expander_Sheet (6 pins)
LIVE: Connector_Sheet (J18.1), Relay_Sheet (16 pins)
RE/DE/RS485/T: Controller_Sheet (U4.20), RS485_RS232_Sheet (5 pins)
RS232_RX: Connector_Sheet (J14.1), RS485_RS232_Sheet (F3.1 TP7.1)
RS232_TX: Connector_Sheet (J14.2), RS485_RS232_Sheet (F4.1 TP8.1)
RXD/RS485: Controller_Sheet (U4.21), RS485_RS232_Sheet (R35.1 TP9.1 U8.4)
TXD/RS485: Controller_Sheet (U4.22), RS485_RS232_Sheet (R32.1 TP10.1 U8.1)
BOARD_RS232_RX: Controller_Sheet (U4.56), RS485_RS232_Sheet (U7.9)
BOARD_RS232_TX: Controller_Sheet (U4.55), RS485_RS232_Sheet (U7.10)
CAN_N: CAN_Sheet (R20.2 U5.12), Connector_Sheet (J11.2)
CAN_P: CAN_Sheet (R18.1 U5.13), Connector_Sheet (J11.1)
DIMM_1: Connector_Sheet (J7.1), Controller_Sheet (U4.23)
DIMM_2: Connector_Sheet (J8.1), Controller_Sheet (U4.24)
DIMM_3: Connector_Sheet (J12.1), Controller_Sheet (U4.25)
DIMM_4: Connector_Sheet (J23.1), Controller_Sheet (U4.26)
DIMM_5: Connector_Sheet (J24.1), Controller_Sheet (U4.27)
DIMM_6: Connector_Sheet (J25.1), Controller_Sheet (U4.28)
DIMM_7: Connector_Sheet (J26.1), Controller_Sheet (U4.30)
DIMM_8: Connector_Sheet (J27.1), Controller_Sheet (U4.31)
DIMM_9: Connector_Sheet (J28.1), Controller_Sheet (U4.32)
DIMM_10: Connector_Sheet (J29.1), Controller_Sheet (U4.33)
DIMM_11: Connector_Sheet (J30.1), Controller_Sheet (U4.34)
DIMM_12: Connector_Sheet (J31.1), Controller_Sheet (U4.35)
DIMM_13: Connector_Sheet (J32.1), Controller_Sheet (U4.36)
DIMM_14: Connector_Sheet (J33.1), Controller_Sheet (U4.38)
DIMM_15: Connector_Sheet (J34.1), Controller_Sheet (U4.39)
DIMM_16: Connector_Sheet (J35.1), Controller_Sheet (U4.48)
EN_CAN: CAN_Sheet (U5.6), Controller_Sheet (U4.58)
I2C_SCL: Controller_Sheet (R82.1 U4.62), GPIO_Expander_Sheet (U3.12)
I2C_SDA: Controller_Sheet (R81.1 U4.63), GPIO_Expander_Sheet (U3.13)
INH_MASK: CAN_Sheet (U5.11), Controller_Sheet (U4.57)
LEDPOL0: EtherCAT_Sheet (R46.2 U9.48), RJ45_Sheet (R57.1)
LEDPOL1: EtherCAT_Sheet (R47.2 U9.46), RJ45_Sheet (R58.1)
nFAULT_CAN: CAN_Sheet (U5.8), Controller_Sheet (U4.60)
nSTB_CAN: CAN_Sheet (U5.14), Controller_Sheet (U4.59)
RE/DE/RS485/T_2: Controller_Sheet (U4.19), RS485_RS232_Sheet (R22.1 R23.1 U6.2 U6.3)
RELAY1: Relay_Sheet (U10.1), GPIO_Expander_Sheet (U3.21)
RELAY2: Relay_Sheet (U10.2), GPIO_Expander_Sheet (U3.22)
RELAY3: Relay_Sheet (U10.3), GPIO_Expander_Sheet (U3.23)
RELAY4: Relay_Sheet (U10.4), GPIO_Expander_Sheet (U3.24)
RELAY5: Relay_Sheet (U10.5), GPIO_Expander_Sheet (U3.25)
RELAY6: Relay_Sheet (U10.6), GPIO_Expander_Sheet (U3.26)
RELAY7: Relay_Sheet (U10.7), GPIO_Expander_Sheet (U3.27)
RELAY8: Relay_Sheet (U11.1), GPIO_Expander_Sheet (U3.28)
RELAY9: Relay_Sheet (U11.2), GPIO_Expander_Sheet (U3.1)
RELAY10: Relay_Sheet (U11.3), GPIO_Expander_Sheet (U3.2)
RELAY11: Relay_Sheet (U11.4), GPIO_Expander_Sheet (U3.3)
RELAY12: Relay_Sheet (U11.5), GPIO_Expander_Sheet (U3.4)
RELAY13: Relay_Sheet (U11.6), GPIO_Expander_Sheet (U3.5)
RELAY14: Relay_Sheet (U11.7), GPIO_Expander_Sheet (U3.6)
RELAY15: Relay_Sheet (U12.1), GPIO_Expander_Sheet (U3.7)
RELAY16: Relay_Sheet (U12.2), GPIO_Expander_Sheet (U3.8)
RS485/2_N: Connector_Sheet (J16.1), RS485_RS232_Sheet (F1.2)
RS485/2_P: Connector_Sheet (J16.2), RS485_RS232_Sheet (F2.2)
RS485_N: Connector_Sheet (J15.1), RS485_RS232_Sheet (F5.2)
RS485_P: Connector_Sheet (J15.2), RS485_RS232_Sheet (F6.2)
RST_1: Controller_Sheet (U4.40), GPIO_Expander_Sheet (R80.1 U3.18)
RXA_N: EtherCAT_Sheet (U9.54), RJ45_Sheet (C47.2 J9.6 R51.1)
RXA_P: EtherCAT_Sheet (U9.55), RJ45_Sheet (C48.2 J9.3 R52.1)
RXB_N: EtherCAT_Sheet (U9.61), RJ45_Sheet (C53.2 J10.6 R59.1)
RXB_P: EtherCAT_Sheet (U9.60), RJ45_Sheet (C54.2 J10.3 R60.1)
RXD/RS485_2: Controller_Sheet (U4.17), RS485_RS232_Sheet (R24.1 U6.4)
SPI2_MISO: Controller_Sheet (U4.53), EtherCAT_Sheet (U9.13)
SPI2_MOSI: Controller_Sheet (U4.54), EtherCAT_Sheet (U9.17)
SPI2_NSS: Controller_Sheet (U4.50), EtherCAT_Sheet (U9.50)
SPI2_SCK: Controller_Sheet (U4.51), EtherCAT_Sheet (U9.19)
SYNC0: Controller_Sheet (U4.14), EtherCAT_Sheet (U9.34)
SYNC1: Controller_Sheet (U4.13), EtherCAT_Sheet (U9.18)
TXA_N: EtherCAT_Sheet (U9.52), RJ45_Sheet (C49.2 J9.2 R53.1)
TXA_P: EtherCAT_Sheet (U9.53), RJ45_Sheet (C50.2 J9.1 R54.1)
TXB_N: EtherCAT_Sheet (U9.63), RJ45_Sheet (C55.2 J10.2 R61.1)
TXB_P: EtherCAT_Sheet (U9.62), RJ45_Sheet (C56.2 J10.1 R62.1)
TXD/RS485_2: Controller_Sheet (U4.18), RS485_RS232_Sheet (R21.1 U6.1)